# Altium project Dendrometro.PrjPcb
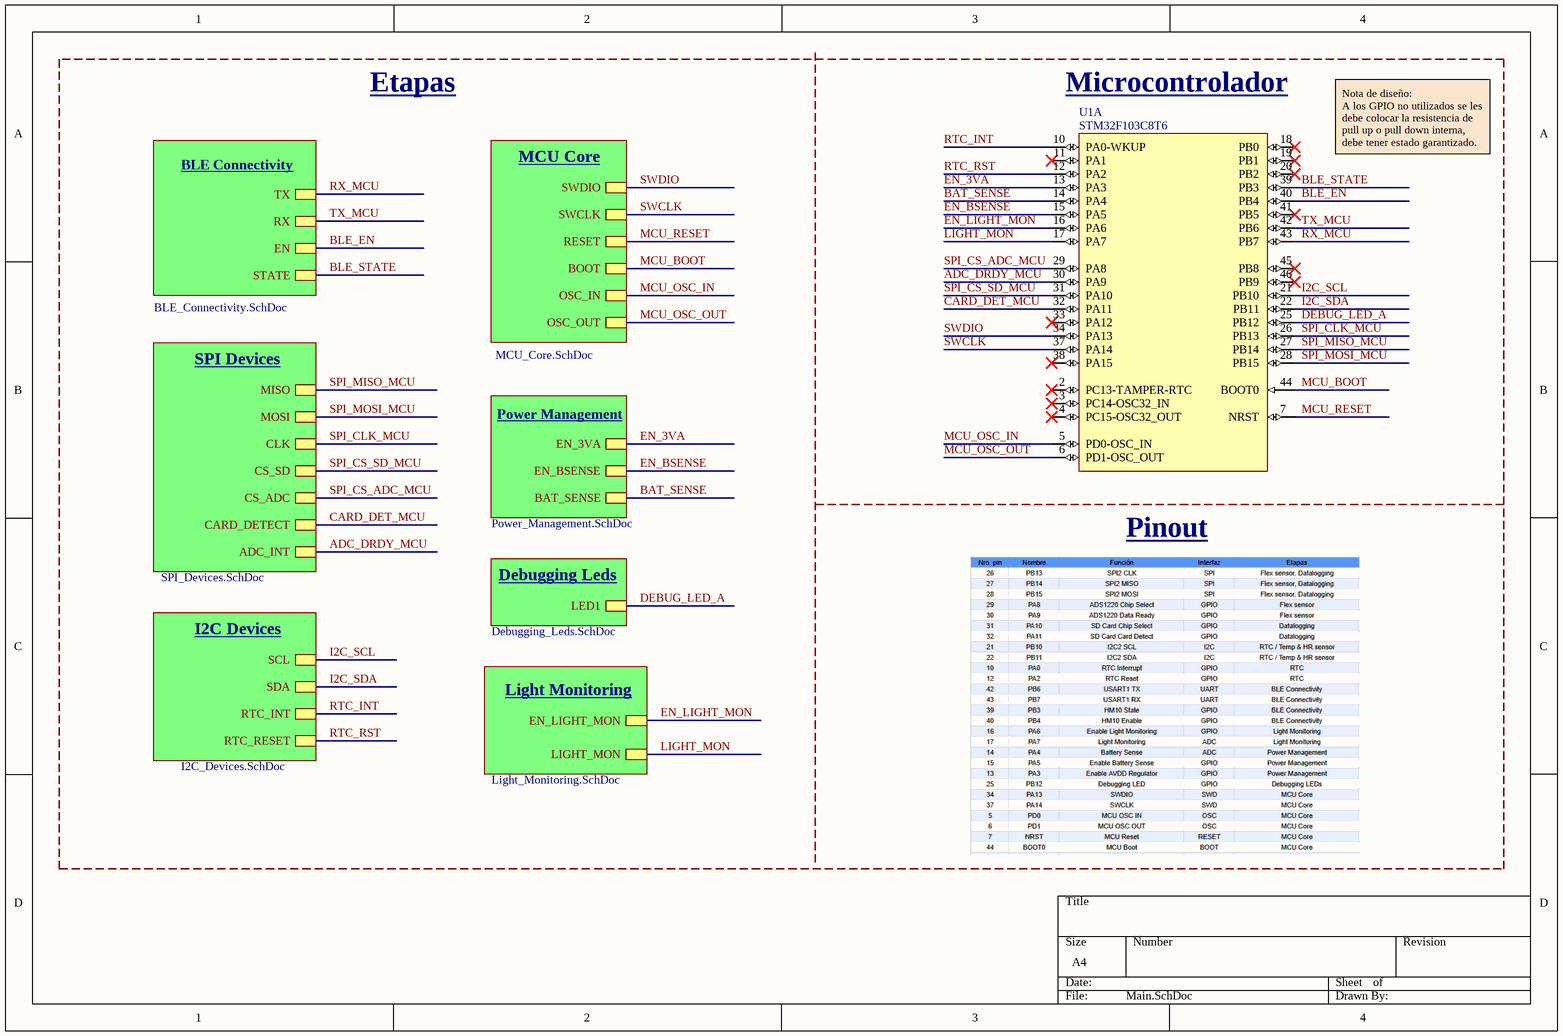
[diagram p0: Main.SchDoc]
11 sheets, 138 parts. Net scope: hierarchical (ports join the sheet entries above them; power ports are global).
Board file: Layout_Dendrometro.PcbDoc
Sheets:
  Main.SchDoc
    Power_Management = Power_Management.SchDoc
    MCU_Core = MCU_Core.SchDoc
    I2C_Devices = I2C_Devices.SchDoc
    BLE_Connectivity = BLE_Connectivity.SchDoc
    Light_Monitoring = Light_Monitoring.SchDoc
    SPI_Devices = SPI_Devices.SchDoc
      Datalogging = Datalogging.SchDoc
      Flex_Sensor = Flex_Sensor.SchDoc
        ADS_AFE = ADS_AFE.SchDoc
    Debugging_Leds = Debugging_Leds.SchDoc

## Sheet Main.SchDoc
size A4; SheetNumber: 1; SheetTotal: 11

### Parts
U1  STM32F103C8T6  [STM-LQFP48_L]  (part A of 2)

### Sub-sheets
BLE_Connectivity = BLE_Connectivity.SchDoc: TX, RX, EN, STATE  | Titulo: BLE Connectivity
Debugging_Leds = Debugging_Leds.SchDoc: LED1  | Titulo: Debugging Leds
I2C_Devices = I2C_Devices.SchDoc: SCL, SDA, RTC_INT, RTC_RESET  | Titulo: I2C Devices
Light_Monitoring = Light_Monitoring.SchDoc: EN_LIGHT_MON, LIGHT_MON  | Titulo: Light Monitoring
MCU_Core = MCU_Core.SchDoc: SWDIO, SWCLK, RESET, BOOT, OSC_IN, OSC_OUT  | Titulo: MCU Core
Power_Management = Power_Management.SchDoc: EN_3VA, BAT_SENSE, EN_BSENSE  | Titulo: Power Management
SPI_Devices = SPI_Devices.SchDoc: MISO, MOSI, CLK, CS_SD, CS_ADC, CARD_DETECT, ADC_INT  | Titulo: SPI Devices

### Nets
ADC_DRDY_MCU: U1.30(PA9) ; sheet SPI_Devices/ADC_INT
BAT_SENSE: U1.14(PA4) ; sheet Power_Management/BAT_SENSE
BLE_EN: U1.40(PB4) ; sheet BLE_Connectivity/EN
BLE_STATE: U1.39(PB3) ; sheet BLE_Connectivity/STATE
CARD_DET_MCU: U1.32(PA11) ; sheet SPI_Devices/CARD_DETECT
DEBUG_LED_A: U1.25(PB12) ; sheet Debugging_Leds/LED1
EN_3VA: U1.13(PA3) ; sheet Power_Management/EN_3VA
EN_BSENSE: U1.15(PA5) ; sheet Power_Management/EN_BSENSE
EN_LIGHT_MON: U1.16(PA6) ; sheet Light_Monitoring/EN_LIGHT_MON
I2C_SCL: U1.21(PB10) ; sheet I2C_Devices/SCL
I2C_SDA: U1.22(PB11) ; sheet I2C_Devices/SDA
LIGHT_MON: U1.17(PA7) ; sheet Light_Monitoring/LIGHT_MON
MCU_BOOT: U1.44(BOOT0) ; sheet MCU_Core/BOOT
MCU_OSC_IN: U1.5(PD0-OSC_IN) ; sheet MCU_Core/OSC_IN
MCU_OSC_OUT: U1.6(PD1-OSC_OUT) ; sheet MCU_Core/OSC_OUT
MCU_RESET: U1.7(NRST) ; sheet MCU_Core/RESET
RTC_INT: U1.10(PA0-WKUP) ; sheet I2C_Devices/RTC_INT
RTC_RST: U1.12(PA2) ; sheet I2C_Devices/RTC_RESET
RX_MCU: U1.43(PB7) ; sheet BLE_Connectivity/TX
SPI_CLK_MCU: U1.26(PB13) ; sheet SPI_Devices/CLK
SPI_CS_ADC_MCU: U1.29(PA8) ; sheet SPI_Devices/CS_ADC
SPI_CS_SD_MCU: U1.31(PA10) ; sheet SPI_Devices/CS_SD
SPI_MISO_MCU: U1.27(PB14) ; sheet SPI_Devices/MISO
SPI_MOSI_MCU: U1.28(PB15) ; sheet SPI_Devices/MOSI
SWCLK: U1.37(PA14) ; sheet MCU_Core/SWCLK
SWDIO: U1.34(PA13) ; sheet MCU_Core/SWDIO
TX_MCU: U1.42(PB6) ; sheet BLE_Connectivity/RX

Not connected (* = marked no-connect by the designer): U1 2(PC13-TAMPER-RTC)* 3(PC14-OSC32_IN)* 4(PC15-OSC32_OUT)* 11(PA1)* 18(PB0)* 19(PB1)* 20(PB2)* 33(PA12)* 38(PA15)* 41(PB5)* 45(PB8)* 46(PB9)*

### Notes on the sheet
- Etapas
- (near U1) Microcontrolador
- Nota de diseño:
  A los GPIO no utilizados se les debe colocar la resistencia de pull up o pull down interna, debe tener estado garantizado.
- Pinout

### Library data of the parts
U1 = STM32F103C8T6: ARM Cortex-M3 32-bit MCU, 64 KB Flash, 20 KB Internal RAM, 37 I/Os, 48-pin LQFP, -40 to 85 degC, Tray; Supply Voltage(Vcc) min (V): 2; Internal RAM Size (kB): 20; FLASH Size (Prog) (kB): 64; A/D Converter: 2x12-bit (10 Channel); I/Os (High Current): 37; Operating Frequency(F) (Processor speed) (MHz): 72; Core: ARM Cortex-M3; ComponentLink3Description: Package Specification; Mounting Technology: Surface Mount; PartNumber: STM32F103C8T6; PackageReference: LQFP48; Packing: Tray; ComponentLink3URL: http://www.st.com/st-web-ui/static/active/en/resource/technical/document/datasheet/DM00058181.pdf; DatasheetVersion: Rev. 16; ComponentLink1URL: http://www.st.com/web/en/home.html; PackageVersion: Rev. 6, 06/2013; ComponentLink2URL: http://www.st.com/st-web-ui/static/active/en/resource/technical/document/datasheet/CD00161566.pdf; ComponentLink1Description: Manufacturer URL; ComponentLink2Description: Datasheet; PackageDescription: 48-Pin Low Profile Quad Flat Package, 7 x 7 mm Body, 0.5 mm Pitch

## Sheet Power_Management.SchDoc
size A4; SheetNumber: 2; SheetTotal: 11
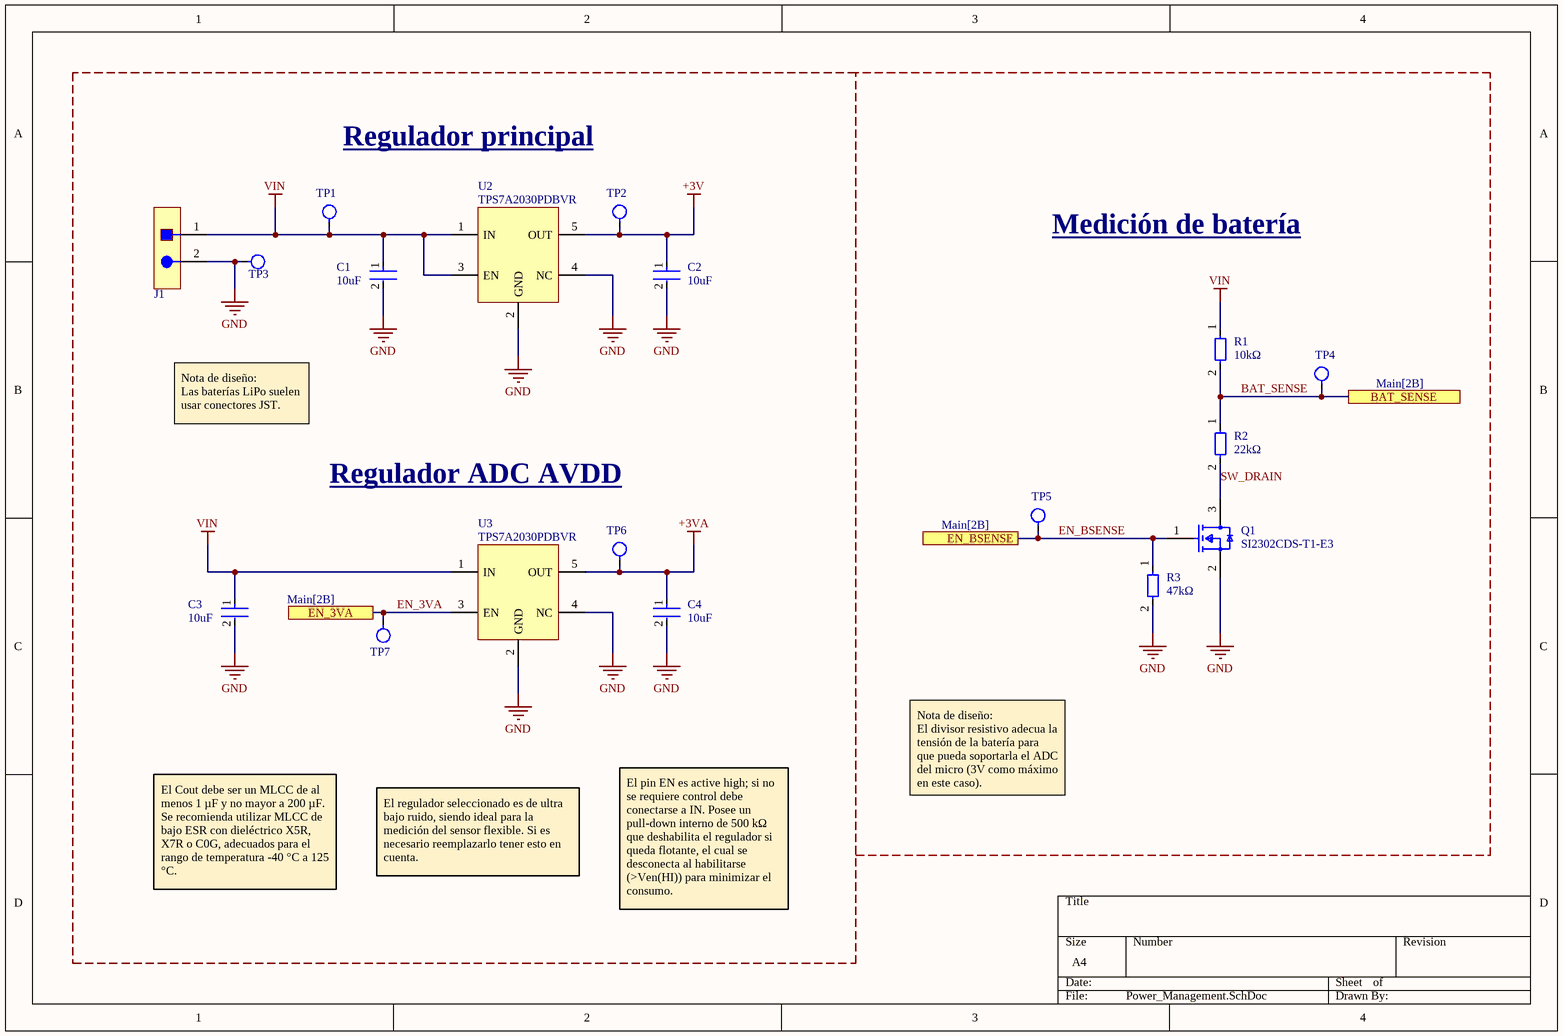
[diagram p1: Power_Management.SchDoc]

### Parts
C1  10uF  [CAP_0603]
C2  10uF  [CAP_0603]
C3  10uF  [CAP_0603]
C4  10uF  [CAP_0603]
J1  JST CONN  [JST_B2B-PH-K-S]  (value not drawn)
Q1  SI2302CDS-T1-E3  [FP-S-03946-MFG]
R1  value 10kΩ  [RES_0603]  (hidden comment: 10k)
R2  value 22kΩ  [RES_0603]  (hidden comment: 22k)
R3  value 47kΩ  [RES_0603]  (hidden comment: 47k)
TP1  Testpoint SMD  [Testpoint_SMD]  (value not drawn)  (no BOM)
TP2  Testpoint SMD  [Testpoint_SMD]  (value not drawn)  (no BOM)
TP3  Testpoint SMD  [Testpoint_SMD]  (value not drawn)  (no BOM)
TP4  Testpoint SMD  [Testpoint_SMD]  (value not drawn)  (no BOM)
TP5  Testpoint SMD  [Testpoint_SMD]  (value not drawn)  (no BOM)
TP6  Testpoint SMD  [Testpoint_SMD]  (value not drawn)  (no BOM)
TP7  Testpoint SMD  [Testpoint_SMD]  (value not drawn)  (no BOM)
U2  TPS7A2030PDBVR  [SOT-23]
U3  TPS7A2030PDBVR  [SOT-23]

### Ports
BAT_SENSE (see Main[2B]), EN_3VA (see Main[2B]), EN_BSENSE (see Main[2B])

### Nets
+3V: C2.1 TP2.1 U2.5(OUT)
+3VA: C4.1 TP6.1 U3.5(OUT)
GND: C1.2 C2.2 C3.2 C4.2 J1.2 Q1.2(S) R3.2 TP3.1 U2.2(GND) U2.4(NC) U3.2(GND) U3.4(NC)
VIN: C1.1 C3.1 J1.1 R1.1 TP1.1 U2.1(IN) U2.3(EN) U3.1(IN)
BAT_SENSE: R1.2 R2.1 TP4.1 ; port BAT_SENSE
EN_3VA: TP7.1 U3.3(EN) ; port EN_3VA
EN_BSENSE: Q1.1(G) R3.1 TP5.1 ; port EN_BSENSE
SW_DRAIN: Q1.3(D) R2.2

### Notes on the sheet
- Regulador principal
- Medición de batería
- Nota de diseño:
  Las baterías LiPo suelen usar conectores JST.
- Regulador ADC AVDD
- Nota de diseño:
  El divisor resistivo adecua la tensión de la batería para que pueda soportarla el ADC del micro (3V como máximo en este caso).
- El Cout debe ser un MLCC de al menos 1 µF y no mayor a 200 µF. Se recomienda utilizar MLCC de bajo ESR con dieléctrico X5R, X7R o C0G, adecuados para el rango de temperatura -40 °C a 125 °C.
- El regulador seleccionado es de ultra bajo ruido, siendo ideal para la medición del sensor flexible. Si es necesario reemplazarlo tener esto en cuenta.
- El pin EN es active high; si no se requiere control debe conectarse a IN. Posee un pull-down interno de 500 kΩ que deshabilita el regulador si queda flotante, el cual se desconecta al habilitarse (>Ven(HI)) para minimizar el consumo.

### Library data of the parts
C1-C4 = Generic C: Cap 10 uF 10V X7R 0603; Dielectric: X5R; Tolerance: 10%; Case Code (Imperial): 0805; Capacitance: 10uF; Mount: Surface Mount; Depth: 1.25mm; Length: 2mm; Lead Free: Lead Free; Packaging: Tape and Reel; Width: 0.049inch; Package Quantity: 1; Height: 1.25mm; Case/Package: 0805; Voltage Rating: 10V; Thickness: 0.053inch; Max Operating Temperature: 85°C; Case Code (Metric): 2012; Contact Plating: Tin; Min Operating Temperature: -55°C; Radiation Hardening: No; Voltage Rating (DC): 10V
J1 = B2B-PH-K-S: CONN JST HEADER VERT 2POS 2MM for LIPO batteries.
Q1 = CMP-02550-000184-1: MOSFET N-CH 20V 2.6A SOT-23; Manufacturer: Vishay; Gate To Source Voltage: 8V; Max Forward Diode Voltage: 1.2V; Pulse Drain Current: 10A; Typ Forward Diode Voltage: 0.7V; Number Of N Channels: 1; Reverse Recovery Charge: 2nC; Power Dissipation: 0.71W; Reverse Recovery Time: 8.5ns; Threshold Vgs Min: 0.4V; Drain To Source Resistance: 0.045Ω; Gate Charge At Vgs: 3.5nC @ 4.5V; Turn Off Delay Time: 30ns; Rthja Max: 140°C/W; Max Junction Temp: +150°C; Transconductance: 13S; Depletion Mode: False; Standoff Height: 0.01mm; Turn On Delay Time: 8ns; Threshold Vgs Max: 0.85V; Manufacturer Part Number: SI2302CDS-T1-E3; Mouser Description: MOSFET 20V 2.9A 0.86W 57mohm @ 4.5V; Digikey Description: MOSFET N-CH 20V 2.6A SOT-23; Drain To Source Voltage: 20V; Lead Free: Yes; Temperature Range High: +150°C; Automotive: No; ComponentLink2URL: http://www.vishay.com/docs/68645/si2302cds.pdf; Height: 1.12mm; ComponentLink2Description: Datasheet; Octopart: https://octopart.com/si2302cds-t1-e3-vishay-44452855; Continuous Drain Current: 2.6A; Drain To Source Breakdown Voltage: 20V; Number Of Channels: 1; Device Class L3: MOSFETs; Device Class L1: Discrete Semiconductors; Temperature Range Low: -55°C; Package: S-03946; RoHS: TRUE; Device Class L2: Transistors; Temperature: -55°C to +150°C; Category: Trans
R1 = Generic R: RES  10k 1% 0603
R2 = Generic R: RES  22k 1% 0603
R3 = Generic R: RES  47k 1% 0603
TP1-TP7 = Testpoint_SMD: Testpoint SMD de 1mm de diametro.
U2 U3 = TPS7A2030PDBVR: IC REG LINEAR 3V 300MA SOT23-5

## Sheet MCU_Core.SchDoc
size A4; SheetNumber: 3; SheetTotal: 11
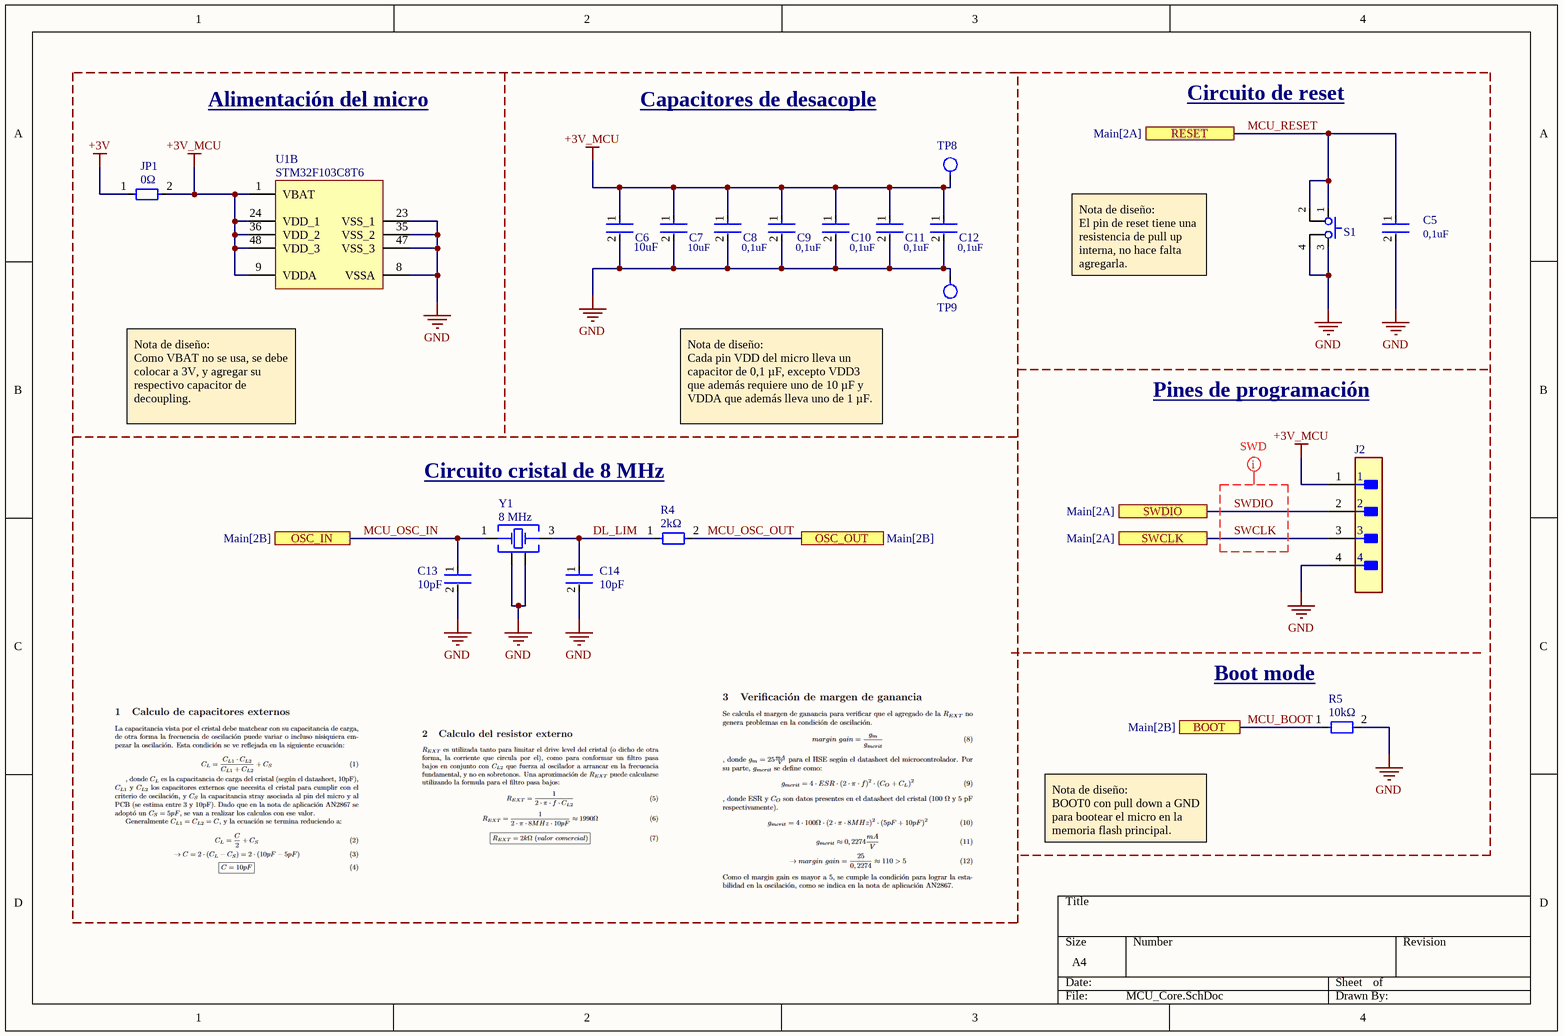
[diagram p2: MCU_Core.SchDoc]

### Parts
C5  Capacitance: 0,1uF  [CAP_0603]  (hidden comment: 0.1uF)
C6  10uF  [CAP_0603]
C7  10uF  [CAP_0603]
C8  Capacitance: 0,1uF  [CAP_0603]  (hidden comment: 0.1uF)
C9  Capacitance: 0,1uF  [CAP_0603]  (hidden comment: 0.1uF)
C10  Capacitance: 0,1uF  [CAP_0603]  (hidden comment: 0.1uF)
C11  Capacitance: 0,1uF  [CAP_0603]  (hidden comment: 0.1uF)
C12  Capacitance: 0,1uF  [CAP_0603]  (hidden comment: 0.1uF)
C13  10pF  [CAP_0603]
C14  10pF  [CAP_0603]
J2  HTSW-104-07-G-S  [FP-HTSW-104-07-G-S-MFG]  (value not drawn)
JP1  value 0Ω  [RES_0R_0603]  (hidden comment: Generic JP)  (no BOM)
R4  value 2kΩ  [RES_0603]  (hidden comment: 2k)
R5  value 10kΩ  [RES_0603]  (hidden comment: 10k)
S1  Tactile push button 5,2mm x 5,2mm  [Switch Tactile 5,2mm x 5,2mm]  (value not drawn)
TP8  Testpoint SMD  [Testpoint_SMD]  (value not drawn)  (no BOM)
TP9  Testpoint SMD  [Testpoint_SMD]  (value not drawn)  (no BOM)
U1  STM32F103C8T6  [STM-LQFP48_L]  (part B of 2)
Y1  Frequency: 8 MHz  [SMD5032-4P]  (hidden comment: Crystal SMD 4-P)

### Ports
BOOT (see Main[2B]), OSC_IN (see Main[2B]), OSC_OUT (see Main[2B]), RESET (see Main[2A]), SWCLK (see Main[2A]), SWDIO (see Main[2A])

### Nets
+3V: JP1.1
+3V_MCU: C6.1 C7.1 C8.1 C9.1 C10.1 C11.1 C12.1 J2.1 JP1.2 TP8.1 U1.1(VBAT) U1.9(VDDA) U1.24(VDD_1) U1.36(VDD_2) U1.48(VDD_3)
GND: C5.2 C6.2 C7.2 C8.2 C9.2 C10.2 C11.2 C12.2 C13.2 C14.2 J2.4 R5.2 S1.3 S1.4 TP9.1 U1.8(VSSA) U1.23(VSS_1) U1.35(VSS_2) U1.47(VSS_3) Y1.2(GND_&_Lid) Y1.4(GND_&_Lid)
DL_LIM: C14.1 R4.1 Y1.3(Crystal)
MCU_BOOT: R5.1 ; port BOOT
MCU_OSC_IN: C13.1 Y1.1(Crystal) ; port OSC_IN
MCU_OSC_OUT: R4.2 ; port OSC_OUT
MCU_RESET: C5.1 S1.1 S1.2 ; port RESET
SWCLK: J2.3 ; port SWCLK
SWDIO: J2.2 ; port SWDIO

### Layout directives
net class SWD: SWCLK, SWDIO

### Notes on the sheet
- Alimentación del micro
- Capacitores de desacople
- Circuito de reset
- Nota de diseño:
  El pin de reset tiene una resistencia de pull up interna, no hace falta agregarla.
- Nota de diseño:
  Como VBAT no se usa, se debe colocar a 3V, y agregar su respectivo capacitor de decoupling.
- Nota de diseño:
  Cada pin VDD del micro lleva un capacitor de 0,1 µF, excepto VDD3 que además requiere uno de 10 µF y VDDA que además lleva uno de 1 µF.
- Pines de programación
- Circuito cristal de 8 MHz
- (near R5) Boot mode
- Nota de diseño:
  BOOT0 con pull down a GND para bootear el micro en la memoria flash principal.

### Library data of the parts
C5 C8-C12 = Generic C: Cap 0.1 uF 10V X7R 0603; Dielectric: X5R; Tolerance: 10%; Case Code (Imperial): 0805; Mount: Surface Mount; Depth: 1.25mm; Length: 2mm; Lead Free: Lead Free; Packaging: Tape and Reel; Width: 0.049inch; Package Quantity: 1; Height: 1.25mm; Case/Package: 0805; Voltage Rating: 10V; Thickness: 0.053inch; Max Operating Temperature: 85°C; Case Code (Metric): 2012; Contact Plating: Tin; Min Operating Temperature: -55°C; Radiation Hardening: No; Voltage Rating (DC): 10V
C6 C7 = Generic C: as C1 on sheet Power_Management; Case Code (Imperial): 0805; Capacitance: 10uF; Mount: Surface Mount; Depth: 1.25mm; Length: 2mm; Lead Free: Lead Free; Packaging: Tape and Reel; Width: 0.049inch; Package Quantity: 1; Height: 1.25mm; Case/Package: 0805; Voltage Rating: 10V; Thickness: 0.053inch; Max Operating Temperature: 85°C; Case Code (Metric): 2012; Contact Plating: Tin; Min Operating Temperature: -55°C; Radiation Hardening: No; Voltage Rating (DC): 10V
C13 C14 = Generic C: Cap 10 pF 10V X7R 0603; Dielectric: X5R; Tolerance: 10%; Case Code (Imperial): 0805; Capacitance: 10pF; Mount: Surface Mount; Depth: 1.25mm; Length: 2mm; Lead Free: Lead Free; Packaging: Tape and Reel; Width: 0.049inch; Package Quantity: 1; Height: 1.25mm; Case/Package: 0805; Voltage Rating: 10V; Thickness: 0.053inch; Max Operating Temperature: 85°C; Case Code (Metric): 2012; Contact Plating: Tin; Min Operating Temperature: -55°C; Radiation Hardening: No; Voltage Rating (DC): 10V
J2 = CMP-02766-001776-1: CONN HEADER VERT 4POS 2.54MM; Gender: Male; Number of Contacts: 4; Packaging: Bulk; RoHS Compliant: Yes; Number of Rows: 1; Mount: Through Hole; Contact Material: Bronze; Series: HTSW; Radiation Hardening: No; Pitch: 2.54mm; Reach SVHC Compliant: Yes; Contact Plating: Gold; Termination: Through Hole
JP1 = Generic JP: Generic Jumper
R4 = Generic R: RES  2k 1% 0603
R5 = Generic R: RES  10k 1% 0603
S1 = Tactile push button 5,2mm x 5,2mm: Switch Tactile SPST-NO 5,2mm x 5,2mm
TP8 TP9 = Testpoint_SMD: Testpoint SMD de 1mm de diametro.
U1 = STM32F103C8T6: as U1 on sheet Main; Core: ARM Cortex-M3; ComponentLink3Description: Package Specification; Mounting Technology: Surface Mount; PartNumber: STM32F103C8T6; PackageReference: LQFP48; Packing: Tray; ComponentLink3URL: http://www.st.com/st-web-ui/static/active/en/resource/technical/document/datasheet/DM00058181.pdf; DatasheetVersion: Rev. 16; ComponentLink1URL: http://www.st.com/web/en/home.html; PackageVersion: Rev. 6, 06/2013; ComponentLink2URL: http://www.st.com/st-web-ui/static/active/en/resource/technical/document/datasheet/CD00161566.pdf; ComponentLink1Description: Manufacturer URL; ComponentLink2Description: Datasheet; PackageDescription: 48-Pin Low Profile Quad Flat Package, 7 x 7 mm Body, 0.5 mm Pitch
Y1 = Crystal SMD 4-P: Cristal SMD 4-P 8 MHz; Manufacturer part: SX5B8.000F1020F30; Manufacturer: Shenzhen SCTF Elec; CL: 10 pF; ESR: 100 Ω; Datasheet: https://jlcpcb.com/api/file/downloadByFileSystemAccessId/8590208237112238080; Package: SMD5032-4P

## Sheet I2C_Devices.SchDoc
size A4; SheetNumber: 4; SheetTotal: 11
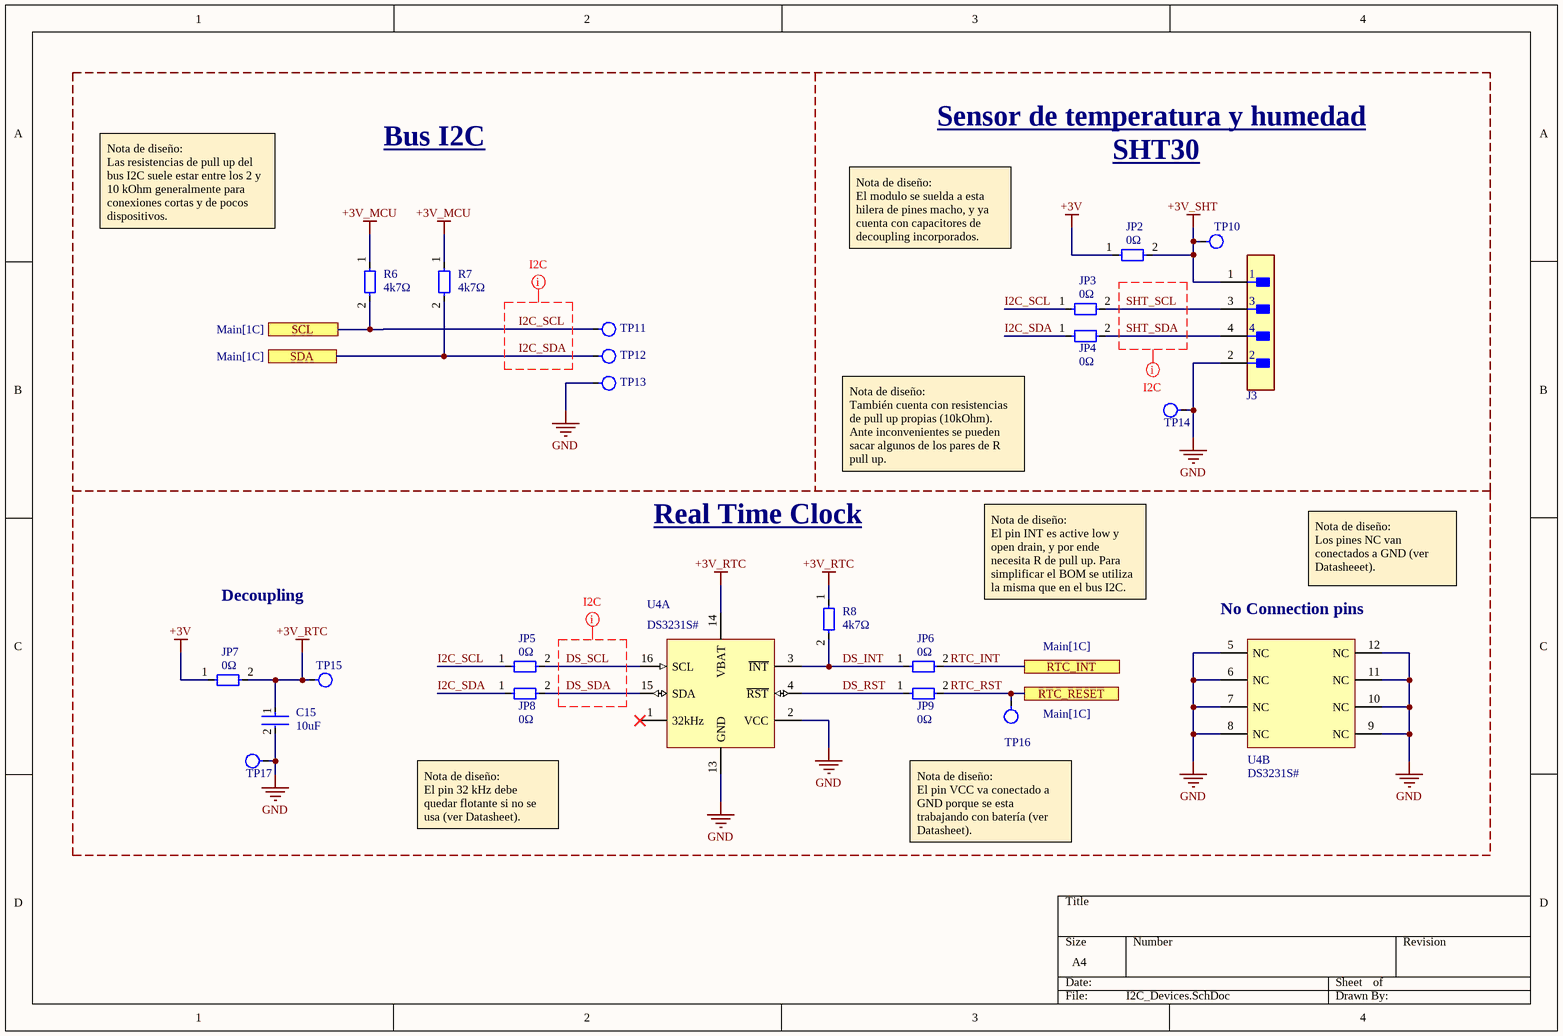
[diagram p3: I2C_Devices.SchDoc]

### Parts
C15  10uF  [CAP_0603]
J3  HTSW-104-07-G-S  [FP-HTSW-104-07-G-S-MFG]  (value not drawn)
JP2  value 0Ω  [RES_0R_0603]  (hidden comment: Generic JP)  (no BOM)
JP3  value 0Ω  [RES_0R_0603]  (hidden comment: Generic JP)  (no BOM)
JP4  value 0Ω  [RES_0R_0603]  (hidden comment: Generic JP)  (no BOM)
JP5  value 0Ω  [RES_0R_0603]  (hidden comment: Generic JP)  (no BOM)
JP6  value 0Ω  [RES_0R_0603]  (hidden comment: Generic JP)  (no BOM)
JP7  value 0Ω  [RES_0R_0603]  (hidden comment: Generic JP)  (no BOM)
JP8  value 0Ω  [RES_0R_0603]  (hidden comment: Generic JP)  (no BOM)
JP9  value 0Ω  [RES_0R_0603]  (hidden comment: Generic JP)  (no BOM)
R6  value 4k7Ω  [RES_0603]  (hidden comment: 4k7)
R7  value 4k7Ω  [RES_0603]  (hidden comment: 4k7)
R8  value 4k7Ω  [RES_0603]  (hidden comment: 4k7)
TP10  Testpoint SMD  [Testpoint_SMD]  (value not drawn)  (no BOM)
TP11  Testpoint SMD  [Testpoint_SMD]  (value not drawn)  (no BOM)
TP12  Testpoint SMD  [Testpoint_SMD]  (value not drawn)  (no BOM)
TP13  Testpoint SMD  [Testpoint_SMD]  (value not drawn)  (no BOM)
TP14  Testpoint SMD  [Testpoint_SMD]  (value not drawn)  (no BOM)
TP15  Testpoint SMD  [Testpoint_SMD]  (value not drawn)  (no BOM)
TP16  Testpoint SMD  [Testpoint_SMD]  (value not drawn)  (no BOM)
TP17  Testpoint SMD  [Testpoint_SMD]  (value not drawn)  (no BOM)
U4  DS3231S#  [SOIC_16_M]  (parts A,B of 2)

### Ports
RTC_INT (see Main[1C]), RTC_RESET (see Main[1C]), SCL (see Main[1C]), SDA (see Main[1C])

### Nets
+3V: JP2.1 JP7.1
+3V_MCU: R6.1 R7.1
+3V_RTC: C15.1 JP7.2 R8.1 TP15.1 U4.14(VBAT)
+3V_SHT: J3.1 JP2.2 TP10.1
GND: C15.2 J3.2 TP13.1 TP14.1 TP17.1 U4.2(VCC) U4.5(NC) U4.6(NC) U4.7(NC) U4.8(NC) U4.9(NC) U4.10(NC) U4.11(NC) U4.12(NC) U4.13(GND)
DS_INT: JP6.1 R8.2 U4.3(~{INT})
DS_RST: JP9.1 U4.4(~{RST})
DS_SCL: JP5.2 U4.16(SCL)
DS_SDA: JP8.2 U4.15(SDA)
I2C_SCL: JP3.1 JP5.1 R6.2 TP11.1 ; port SCL
I2C_SDA: JP4.1 JP8.1 R7.2 TP12.1 ; port SDA
RTC_INT: JP6.2 ; port RTC_INT
RTC_RST: JP9.2 TP16.1 ; port RTC_RESET
SHT_SCL: J3.3 JP3.2
SHT_SDA: J3.4 JP4.2

Not connected (* = marked no-connect by the designer): U4 1(32kHz)*

### Layout directives
net class I2C: DS_SCL, DS_SDA, I2C_SCL, I2C_SDA, SHT_SCL, SHT_SDA

### Notes on the sheet
- Bus I2C
- Sensor de temperatura y humedad
- SHT30
- Nota de diseño:
  Las resistencias de pull up del bus I2C suele estar entre los 2 y 10 kOhm generalmente para conexiones cortas y de pocos dispositivos.
- Nota de diseño:
  El modulo se suelda a esta hilera de pines macho, y ya cuenta con capacitores de decoupling incorporados.
- Nota de diseño:
  También cuenta con resistencias de pull up propias (10kOhm). Ante inconvenientes se pueden sacar algunos de los pares de R pull up.
- Real Time Clock
- Nota de diseño:
  Los pines NC van conectados a GND (ver Datasheeet).
- Decoupling
- Nota de diseño:
  El pin INT es active low y open drain, y por ende necesita R de pull up. Para simplificar el BOM se utiliza la misma que en el bus I2C.
- (near U4) No Connection pins
- Nota de diseño:
  El pin 32 kHz debe quedar flotante si no se usa (ver Datasheet).
- Nota de diseño:
  El pin VCC va conectado a GND porque se esta trabajando con batería (ver Datasheet).

### Library data of the parts
C15 = Generic C: Cap 10  uF 10V X7R 0603; Dielectric: X5R; Tolerance: 10%; Case Code (Imperial): 0805; Capacitance: 10uF; Mount: Surface Mount; Depth: 1.25mm; Length: 2mm; Lead Free: Lead Free; Packaging: Tape and Reel; Width: 0.049inch; Package Quantity: 1; Height: 1.25mm; Case/Package: 0805; Voltage Rating: 10V; Thickness: 0.053inch; Max Operating Temperature: 85°C; Case Code (Metric): 2012; Contact Plating: Tin; Min Operating Temperature: -55°C; Radiation Hardening: No; Voltage Rating (DC): 10V
J3 = CMP-02766-001776_ALT: CONN HEADER VERT 4POS 2.54MM. Versión alterna.; Gender: Male; Number of Contacts: 4; Pitch: 2.54mm; Packaging: Bulk; RoHS Compliant: Yes; Number of Rows: 1; Mount: Through Hole; Contact Material: Bronze; Series: HTSW; Radiation Hardening: No; Reach SVHC Compliant: Yes; Contact Plating: Gold; Termination: Through Hole
JP2-JP9 = Generic JP: Simbolo de jumper genérico
R6-R8 = Generic R: RES  4k7 1% 0603
TP10-TP17 = Testpoint_SMD: Testpoint SMD de 1mm de diametro.
U4 = DS3231S# for battery use: IC RTC CLK/CALENDAR I2C 16SOIC. Symbol used with battery as the main supply voltage.

## Sheet BLE_Connectivity.SchDoc
size A4; SheetNumber: 5; SheetTotal: 11
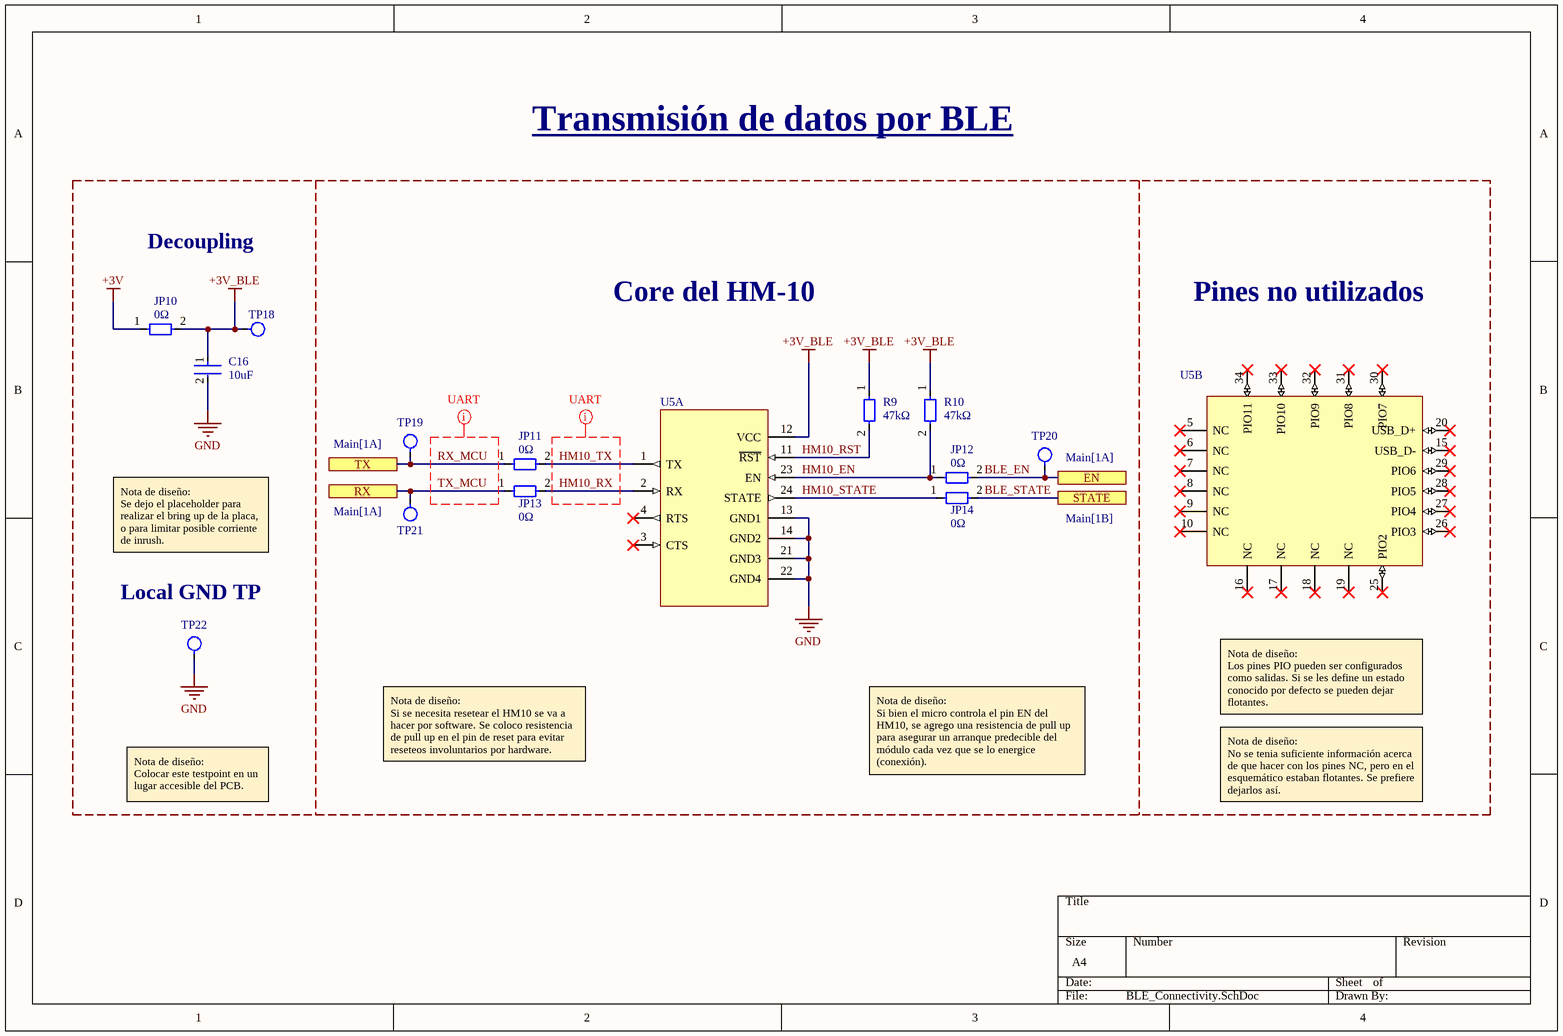
[diagram p4: BLE_Connectivity.SchDoc]

### Parts
C16  10uF  [CAP_0603]
JP10  value 0Ω  [RES_0R_0603]  (hidden comment: Generic JP)  (no BOM)
JP11  value 0Ω  [RES_0R_0603]  (hidden comment: Generic JP)  (no BOM)
JP12  value 0Ω  [RES_0R_0603]  (hidden comment: Generic JP)  (no BOM)
JP13  value 0Ω  [RES_0R_0603]  (hidden comment: Generic JP)  (no BOM)
JP14  value 0Ω  [RES_0R_0603]  (hidden comment: Generic JP)  (no BOM)
R9  value 47kΩ  [RES_0603]  (hidden comment: 47k)
R10  value 47kΩ  [RES_0603]  (hidden comment: 47k)
TP18  Testpoint SMD  [Testpoint_SMD]  (value not drawn)  (no BOM)
TP19  Testpoint SMD  [Testpoint_SMD]  (value not drawn)  (no BOM)
TP20  Testpoint SMD  [Testpoint_SMD]  (value not drawn)  (no BOM)
TP21  Testpoint SMD  [Testpoint_SMD]  (value not drawn)  (no BOM)
TP22  Testpoint SMD  [Testpoint_SMD]  (value not drawn)  (no BOM)
U5  HM10 BLE Module  [HM10_FOOTPRINT]  (value not drawn)  (parts A,B of 2)

### Ports
EN (see Main[1A]), RX (see Main[1A]), STATE (see Main[1B]), TX (see Main[1A])

### Nets
+3V: JP10.1
+3V_BLE: C16.1 JP10.2 R9.1 R10.1 TP18.1 U5.12(VCC)
GND: C16.2 TP22.1 U5.13(GND1) U5.14(GND2) U5.21(GND3) U5.22(GND4)
BLE_EN: JP12.2 TP20.1 ; port EN
BLE_STATE: JP14.2 ; port STATE
HM10_EN: JP12.1 R10.2 U5.23(EN)
HM10_RST: R9.2 U5.11(~{RST})
HM10_RX: JP13.2 U5.2(RX)
HM10_STATE: JP14.1 U5.24(STATE)
HM10_TX: JP11.2 U5.1(TX)
RX_MCU: JP11.1 TP19.1 ; port TX
TX_MCU: JP13.1 TP21.1 ; port RX

Not connected (* = marked no-connect by the designer): U5 3(CTS)* 4(RTS)* 5(NC)* 6(NC)* 7(NC)* 8(NC)* 9(NC)* 10(NC)* 15(USB_D-)* 16(NC)* 17(NC)* 18(NC)* 19(NC)* 20(USB_D+)* 25(PIO2)* 26(PIO3)* 27(PIO4)* 28(PIO5)* 29(PIO6)* 30(PIO7)* 31(PIO8)* 32(PIO9)* 33(PIO10)* 34(PIO11)*

### Layout directives
net class UART: HM10_RX, HM10_TX, RX_MCU, TX_MCU

### Notes on the sheet
- Transmisión de datos por BLE
- Decoupling
- Core del HM-10
- Pines no utilizados
- Nota de diseño:
  Se dejo el placeholder para realizar el bring up de la placa, o para limitar posible corriente de inrush.
- (near TP22) Local GND TP
- Nota de diseño:
  Los pines PIO pueden ser configurados como salidas. Si se les define un estado conocido por defecto se pueden dejar flotantes.
- Nota de diseño:
  Si se necesita resetear el HM10 se va a hacer por software. Se coloco resistencia de pull up en el pin de reset para evitar reseteos involuntarios por hardware.
- Nota de diseño:
  Si bien el micro controla el pin EN del HM10, se agrego una resistencia de pull up para asegurar un arranque predecible del módulo cada vez que se lo energice (conexión).
- Nota de diseño:
  Colocar este testpoint en un lugar accesible del PCB.
- Nota de diseño:
  No se tenia suficiente información acerca de que hacer con los pines NC, pero en el esquemático estaban flotantes. Se prefiere dejarlos así.

### Library data of the parts
C16 = Generic C: as C1 on sheet Power_Management; Case Code (Imperial): 0805; Capacitance: 10uF; Mount: Surface Mount; Depth: 1.25mm; Length: 2mm; Lead Free: Lead Free; Packaging: Tape and Reel; Width: 0.049inch; Package Quantity: 1; Height: 1.25mm; Case/Package: 0805; Voltage Rating: 10V; Thickness: 0.053inch; Max Operating Temperature: 85°C; Case Code (Metric): 2012; Contact Plating: Tin; Min Operating Temperature: -55°C; Radiation Hardening: No; Voltage Rating (DC): 10V
JP10-JP14 = Generic JP: Simbolo de jumper genérico
R9 R10 = Generic R: RES  47k 1% 0603
TP18-TP22 = Testpoint_SMD: Testpoint SMD de 1mm de diametro.
U5 = HM10: Modulo BLE HM10 con castellated pads.

## Sheet Light_Monitoring.SchDoc
size A4; SheetNumber: 6; SheetTotal: 11
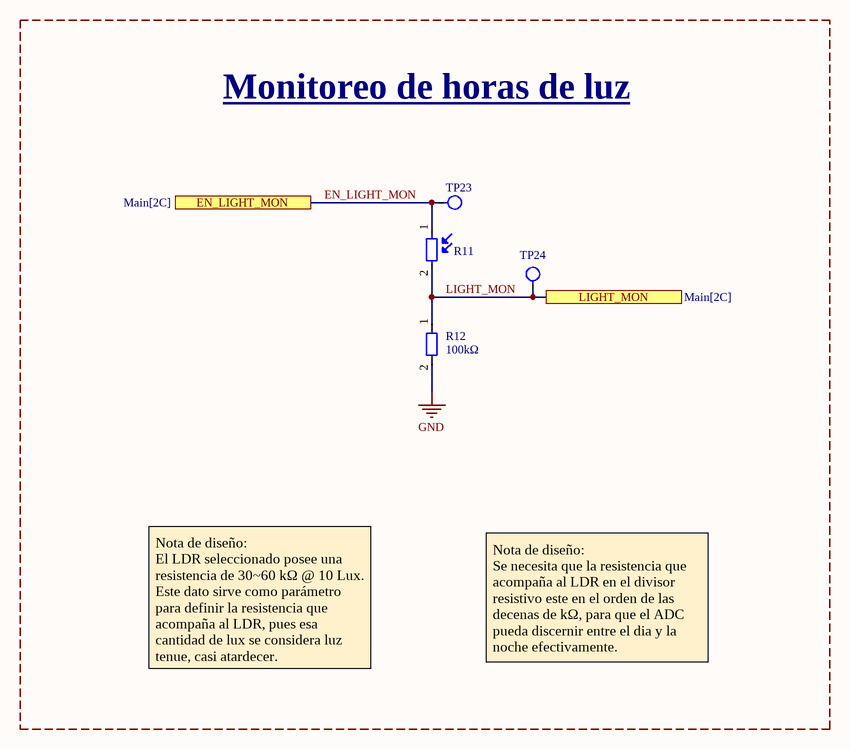
[diagram p5: Light_Monitoring.SchDoc]

### Parts
R11  LDR  [Generic LDR]  (value not drawn)
R12  value 100kΩ  [RES_0603]  (hidden comment: 100k)
TP23  Testpoint SMD  [Testpoint_SMD]  (value not drawn)  (no BOM)
TP24  Testpoint SMD  [Testpoint_SMD]  (value not drawn)  (no BOM)

### Blocks framed on the sheet
Monitoreo de horas de luz: R11 R12 TP23 TP24

### Ports
EN_LIGHT_MON (see Main[2C]), LIGHT_MON (see Main[2C])

### Nets
GND: R12.2
EN_LIGHT_MON: R11.1 TP23.1 ; port EN_LIGHT_MON
LIGHT_MON: R11.2 R12.1 TP24.1 ; port LIGHT_MON

### Notes on the sheet
- Nota de diseño:
  El LDR seleccionado posee una resistencia de 30~60 kΩ @ 10 Lux. Este dato sirve como parámetro para definir la resistencia que acompaña al LDR, pues esa cantidad de lux se considera luz tenue, casi atardecer.
- Nota de diseño:
  Se necesita que la resistencia que acompaña al LDR en el divisor resistivo este en el orden de las decenas de kΩ, para que el ADC pueda discernir entre el dia y la noche efectivamente.

### Library data of the parts
R11 = Generic LDR: LDR for sensing daylight hours.; Light Resistance: 10kΩ; Dark Resistance: 1MΩ; Spectral Response Range: 400-700nm; Diameter: 5mm
R12 = Generic R: RES  100k 1% 0603
TP23 TP24 = Testpoint_SMD: Testpoint SMD de 1mm de diametro.

## Sheet SPI_Devices.SchDoc
size A4; SheetNumber: 7; SheetTotal: 11
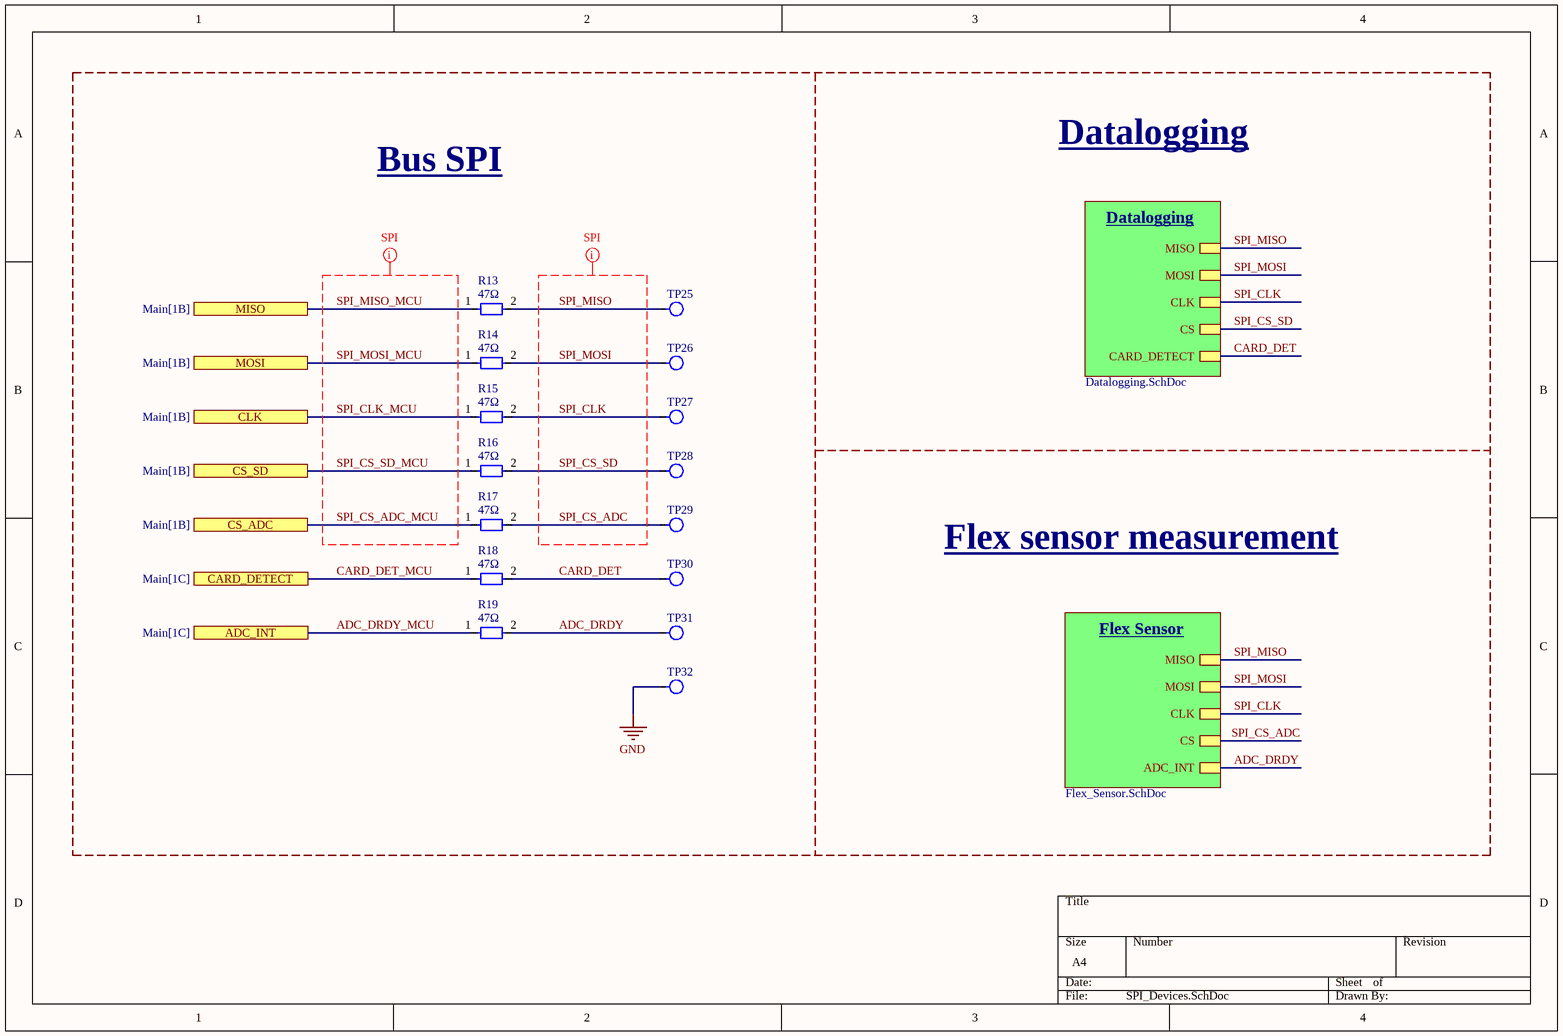
[diagram p6: SPI_Devices.SchDoc]

### Parts
R13  value 47Ω  [RES_0603]  (hidden comment: 47R)
R14  value 47Ω  [RES_0603]  (hidden comment: 47R)
R15  value 47Ω  [RES_0603]  (hidden comment: 47R)
R16  value 47Ω  [RES_0603]  (hidden comment: 47R)
R17  value 47Ω  [RES_0603]  (hidden comment: 47R)
R18  value 47Ω  [RES_0603]  (hidden comment: 47R)
R19  value 47Ω  [RES_0603]  (hidden comment: 47R)
TP25  Testpoint SMD  [Testpoint_SMD]  (value not drawn)  (no BOM)
TP26  Testpoint SMD  [Testpoint_SMD]  (value not drawn)  (no BOM)
TP27  Testpoint SMD  [Testpoint_SMD]  (value not drawn)  (no BOM)
TP28  Testpoint SMD  [Testpoint_SMD]  (value not drawn)  (no BOM)
TP29  Testpoint SMD  [Testpoint_SMD]  (value not drawn)  (no BOM)
TP30  Testpoint SMD  [Testpoint_SMD]  (value not drawn)  (no BOM)
TP31  Testpoint SMD  [Testpoint_SMD]  (value not drawn)  (no BOM)
TP32  Testpoint SMD  [Testpoint_SMD]  (value not drawn)  (no BOM)

### Sub-sheets
Datalogging = Datalogging.SchDoc: MISO, MOSI, CLK, CS, CARD_DETECT  | Titulo: Datalogging
Flex_Sensor = Flex_Sensor.SchDoc: MISO, MOSI, CLK, CS, ADC_INT  | Titulo: Flex Sensor

### Ports
ADC_INT (see Main[1C]), CARD_DETECT (see Main[1C]), CLK (see Main[1B]), CS_ADC (see Main[1B]), CS_SD (see Main[1B]), MISO (see Main[1B]), MOSI (see Main[1B])

### Nets
GND: TP32.1
ADC_DRDY: R19.2 TP31.1 ; sheet Flex_Sensor/ADC_INT
ADC_DRDY_MCU: R19.1 ; port ADC_INT
CARD_DET: R18.2 TP30.1 ; sheet Datalogging/CARD_DETECT
CARD_DET_MCU: R18.1 ; port CARD_DETECT
SPI_CLK: R15.2 TP27.1 ; sheet Datalogging/CLK, sheet Flex_Sensor/CLK
SPI_CLK_MCU: R15.1 ; port CLK
SPI_CS_ADC: R17.2 TP29.1 ; sheet Flex_Sensor/CS
SPI_CS_ADC_MCU: R17.1 ; port CS_ADC
SPI_CS_SD: R16.2 TP28.1 ; sheet Datalogging/CS
SPI_CS_SD_MCU: R16.1 ; port CS_SD
SPI_MISO: R13.2 TP25.1 ; sheet Datalogging/MISO, sheet Flex_Sensor/MISO
SPI_MISO_MCU: R13.1 ; port MISO
SPI_MOSI: R14.2 TP26.1 ; sheet Datalogging/MOSI, sheet Flex_Sensor/MOSI
SPI_MOSI_MCU: R14.1 ; port MOSI

### Layout directives
net class SPI: SPI_CLK, SPI_CLK_MCU, SPI_CS_ADC, SPI_CS_ADC_MCU, SPI_CS_SD, SPI_CS_SD_MCU, SPI_MISO, SPI_MISO_MCU, SPI_MOSI, SPI_MOSI_MCU

### Notes on the sheet
- Bus SPI
- Datalogging
- Flex sensor measurement

### Library data of the parts
R13-R19 = Generic R: RES  47R 1% 0603
TP25-TP32 = Testpoint_SMD: Testpoint SMD de 1mm de diametro.

## Sheet Datalogging.SchDoc
size A4; SheetNumber: 8; SheetTotal: 11
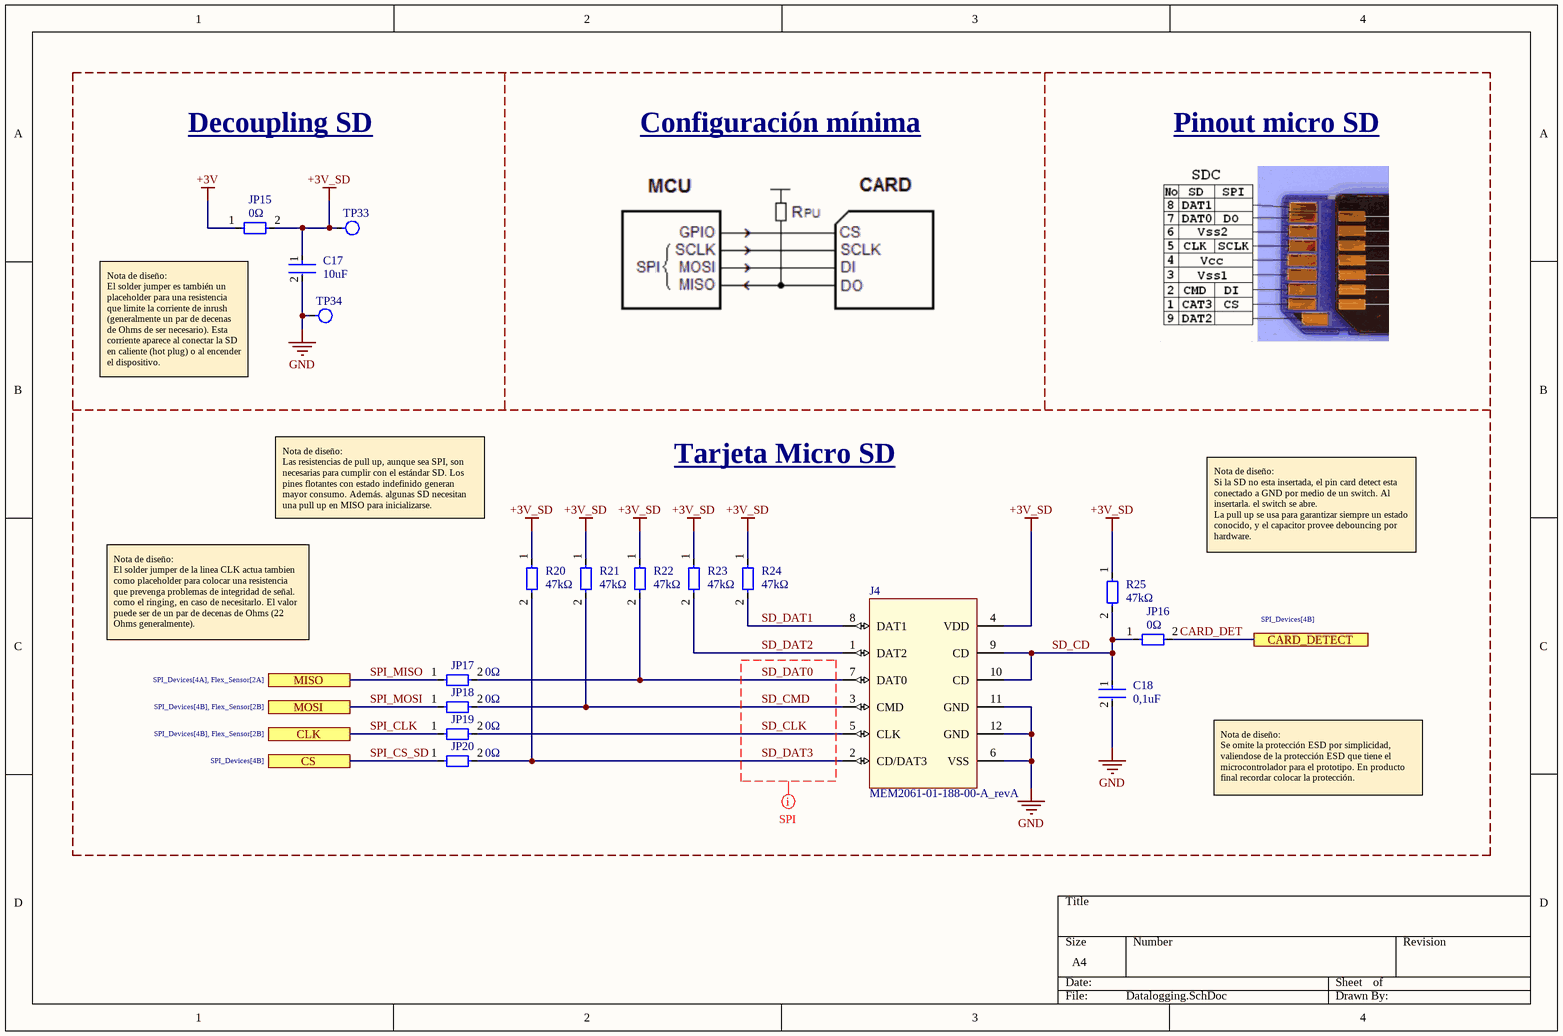
[diagram p7: Datalogging.SchDoc]

### Parts
C17  10uF  [CAP_0603]
C18  Capacitance: 0,1uF  [CAP_0603]  (hidden comment: 0.1uF)
J4  MEM2061-01-188-00-A_revA  [MEM2061-01-188-00-A_revA]
JP15  value 0Ω  [RES_0R_0603]  (hidden comment: Generic JP)  (no BOM)
JP16  value 0Ω  [RES_0R_0603]  (hidden comment: Generic JP)  (no BOM)
JP17  value 0Ω  [RES_0R_0603]  (hidden comment: Generic JP)  (no BOM)
JP18  value 0Ω  [RES_0R_0603]  (hidden comment: Generic JP)  (no BOM)
JP19  value 0Ω  [RES_0R_0603]  (hidden comment: Generic JP)  (no BOM)
JP20  value 0Ω  [RES_0R_0603]  (hidden comment: Generic JP)  (no BOM)
R20  value 47kΩ  [RES_0603]  (hidden comment: 47k)
R21  value 47kΩ  [RES_0603]  (hidden comment: 47k)
R22  value 47kΩ  [RES_0603]  (hidden comment: 47k)
R23  value 47kΩ  [RES_0603]  (hidden comment: 47k)
R24  value 47kΩ  [RES_0603]  (hidden comment: 47k)
R25  value 47kΩ  [RES_0603]  (hidden comment: 47k)
TP33  Testpoint SMD  [Testpoint_SMD]  (value not drawn)  (no BOM)
TP34  Testpoint SMD  [Testpoint_SMD]  (value not drawn)  (no BOM)

### Ports
CARD_DETECT (see SPI_Devices[4B]), CLK (see SPI_Devices[4B], Flex_Sensor[2B]), CS (see SPI_Devices[4B]), MISO (see SPI_Devices[4A], Flex_Sensor[2A]), MOSI (see SPI_Devices[4B], Flex_Sensor[2B])

### Nets
+3V: JP15.1
+3V_SD: C17.1 J4.4(VDD) JP15.2 R20.1 R21.1 R22.1 R23.1 R24.1 R25.1 TP33.1
GND: C17.2 C18.2 J4.6(VSS) J4.11(GND) J4.12(GND) TP34.1
CARD_DET: JP16.2 ; port CARD_DETECT
SD_CD: C18.1 J4.9(CD) J4.10(CD) JP16.1 R25.2
SD_CLK: J4.5(CLK) JP19.2
SD_CMD: J4.3(CMD) JP18.2 R21.2
SD_DAT0: J4.7(DAT0) JP17.2 R22.2
SD_DAT1: J4.8(DAT1) R24.2
SD_DAT2: J4.1(DAT2) R23.2
SD_DAT3: J4.2(CD/DAT3) JP20.2 R20.2
SPI_CLK: JP19.1 ; port CLK
SPI_CS_SD: JP20.1 ; port CS
SPI_MISO: JP17.1 ; port MISO
SPI_MOSI: JP18.1 ; port MOSI

### Layout directives
net class SPI: SD_CLK, SD_CMD, SD_DAT0, SD_DAT3

### Notes on the sheet
- Decoupling SD
- Configuración mínima
- Pinout micro SD
- Nota de diseño:
  El solder jumper es también un placeholder para una resistencia que limite la corriente de inrush (generalmente un par de decenas de Ohms de ser necesario). Esta corriente aparece al conectar la SD en caliente (hot plug) o al encender el dispositivo.
- Nota de diseño:
  Las resistencias de pull up, aunque sea SPI, son necesarias para cumplir con el estándar SD. Los pines flotantes con estado indefinido generan mayor consumo. Además. algunas SD necesitan una pull up en MISO para inicializarse.
- Tarjeta Micro SD
- Nota de diseño:
  Si la SD no esta insertada, el pin card detect esta conectado a GND por medio de un switch. Al insertarla. el switch se abre.
  La pull up se usa para garantizar siempre un estado conocido, y el capacitor provee debouncing por hardware.
- Nota de diseño:
  El solder jumper de la linea CLK actua tambien como placeholder para colocar una resistencia que prevenga problemas de integridad de señal. como el ringing, en caso de necesitarlo. El valor puede ser de un par de decenas de Ohms (22 Ohms generalmente).
- Nota de diseño:
  Se omite la protección ESD por simplicidad, valiendose de la protección ESD que tiene el microcontrolador para el prototipo. En producto final recordar colocar la protección.

### Library data of the parts
C17 = Generic C: as C1 on sheet Power_Management; Case Code (Imperial): 0805; Capacitance: 10uF; Mount: Surface Mount; Depth: 1.25mm; Length: 2mm; Lead Free: Lead Free; Packaging: Tape and Reel; Width: 0.049inch; Package Quantity: 1; Height: 1.25mm; Case/Package: 0805; Voltage Rating: 10V; Thickness: 0.053inch; Max Operating Temperature: 85°C; Case Code (Metric): 2012; Contact Plating: Tin; Min Operating Temperature: -55°C; Radiation Hardening: No; Voltage Rating (DC): 10V
C18 = Generic C: as C5 on sheet MCU_Core; Case Code (Imperial): 0805; Mount: Surface Mount; Depth: 1.25mm; Length: 2mm; Lead Free: Lead Free; Packaging: Tape and Reel; Width: 0.049inch; Package Quantity: 1; Height: 1.25mm; Case/Package: 0805; Voltage Rating: 10V; Thickness: 0.053inch; Max Operating Temperature: 85°C; Case Code (Metric): 2012; Contact Plating: Tin; Min Operating Temperature: -55°C; Radiation Hardening: No; Voltage Rating (DC): 10V
J4 = MEM2061-01-188-00-A_revA: Micro SD Memory Card Connector, 1.88mm Profile SMT,Push Push, with normally closed switch
JP15-JP20 = Generic JP: Simbolo de jumper genérico
R20-R25 = Generic R: RES  47k 1% 0603
TP33 TP34 = Testpoint_SMD: Testpoint SMD de 1mm de diametro.

## Sheet Flex_Sensor.SchDoc
size A4; SheetNumber: 9; SheetTotal: 11
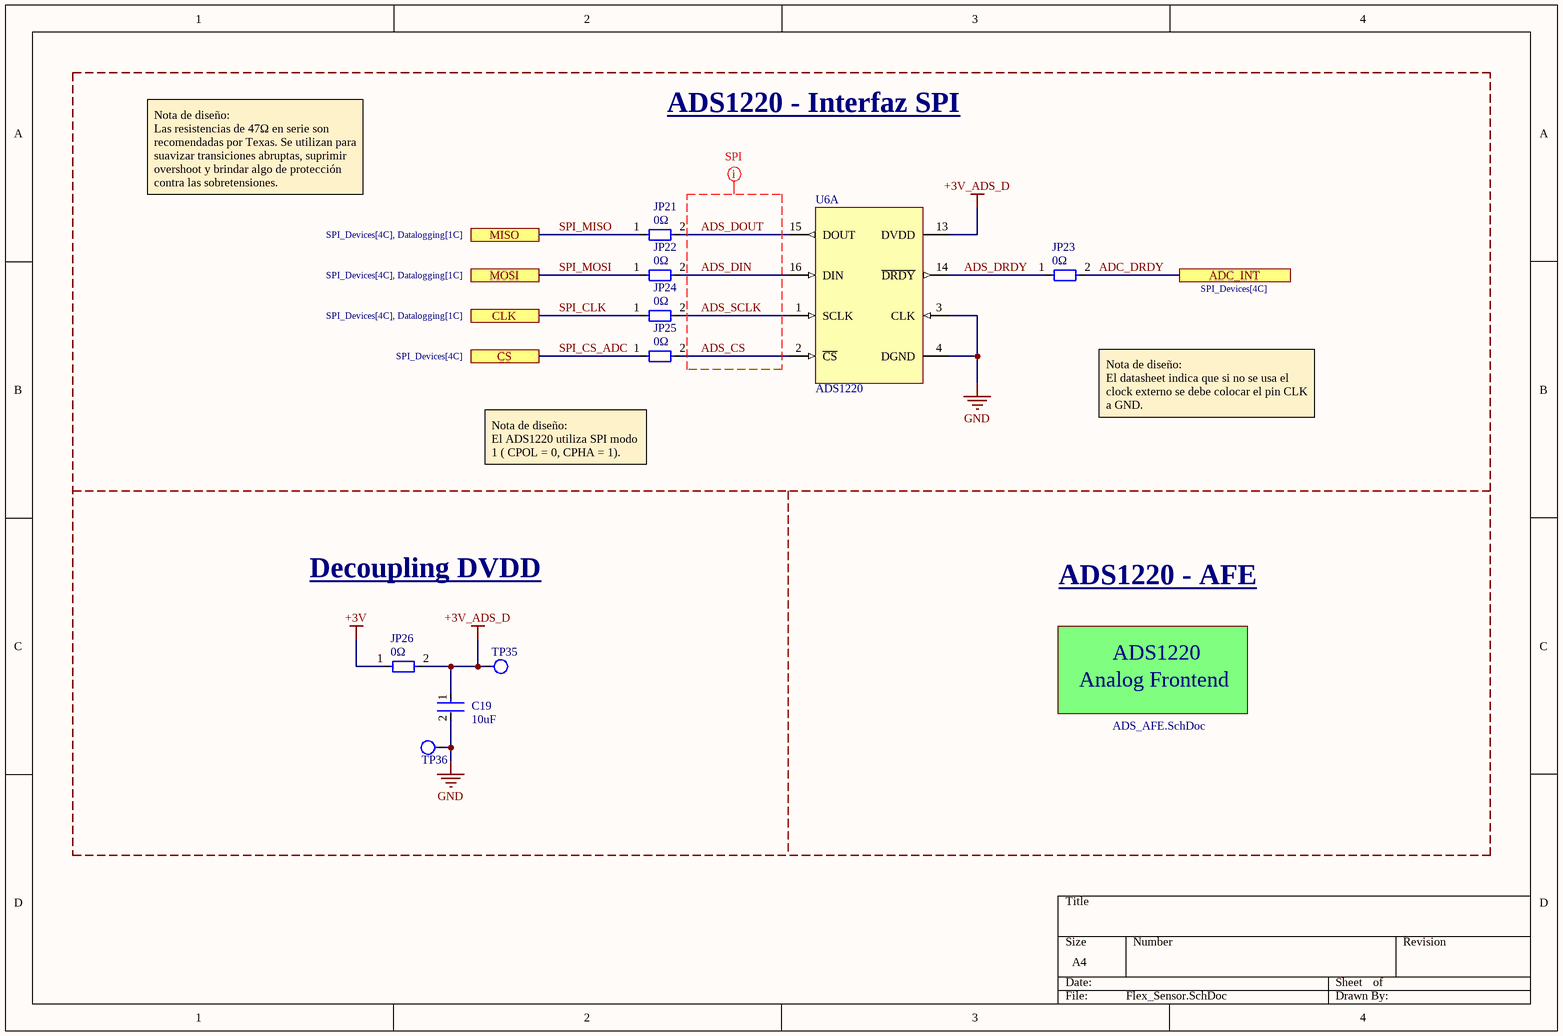
[diagram p8: Flex_Sensor.SchDoc]

### Parts
C19  10uF  [CAP_0603]
JP21  value 0Ω  [RES_0R_0603]  (hidden comment: Generic JP)  (no BOM)
JP22  value 0Ω  [RES_0R_0603]  (hidden comment: Generic JP)  (no BOM)
JP23  value 0Ω  [RES_0R_0603]  (hidden comment: Generic JP)  (no BOM)
JP24  value 0Ω  [RES_0R_0603]  (hidden comment: Generic JP)  (no BOM)
JP25  value 0Ω  [RES_0R_0603]  (hidden comment: Generic JP)  (no BOM)
JP26  value 0Ω  [RES_0R_0603]  (hidden comment: Generic JP)  (no BOM)
TP35  Testpoint SMD  [Testpoint_SMD]  (value not drawn)  (no BOM)
TP36  Testpoint SMD  [Testpoint_SMD]  (value not drawn)  (no BOM)
U6  ADS1220  [TSSOP-16]  (part A of 2)

### Sub-sheets
ADS_AFE = ADS_AFE.SchDoc: no entries  | Titulo: ADS1220; Titulo 2: Analog Frontend

### Ports
ADC_INT (see SPI_Devices[4C]), CLK (see SPI_Devices[4C], Datalogging[1C]), CS (see SPI_Devices[4C]), MISO (see SPI_Devices[4C], Datalogging[1C]), MOSI (see SPI_Devices[4C], Datalogging[1C])

### Nets
+3V: JP26.1
+3V_ADS_D: C19.1 JP26.2 TP35.1 U6.13(DVDD)
GND: C19.2 TP36.1 U6.3(CLK) U6.4(DGND)
ADC_DRDY: JP23.2 ; port ADC_INT
ADS_CS: JP25.2 U6.2(~{CS})
ADS_DIN: JP22.2 U6.16(DIN)
ADS_DOUT: JP21.2 U6.15(DOUT)
ADS_DRDY: JP23.1 U6.14(~{DRDY})
ADS_SCLK: JP24.2 U6.1(SCLK)
SPI_CLK: JP24.1 ; port CLK
SPI_CS_ADC: JP25.1 ; port CS
SPI_MISO: JP21.1 ; port MISO
SPI_MOSI: JP22.1 ; port MOSI

### Layout directives
net class SPI: ADS_CS, ADS_DIN, ADS_DOUT, ADS_SCLK

### Notes on the sheet
- ADS1220 - Interfaz SPI
- Nota de diseño:
  Las resistencias de 47Ω en serie son recomendadas por Texas. Se utilizan para suavizar transiciones abruptas, suprimir overshoot y brindar algo de protección contra las sobretensiones.
- Nota de diseño:
  El datasheet indica que si no se usa el clock externo se debe colocar el pin CLK a GND.
- Nota de diseño:
  El ADS1220 utiliza SPI modo 1 ( CPOL = 0, CPHA = 1).
- Decoupling DVDD
- ADS1220 - AFE

### Library data of the parts
C19 = Generic C: as C1 on sheet Power_Management; Case Code (Imperial): 0805; Capacitance: 10uF; Mount: Surface Mount; Depth: 1.25mm; Length: 2mm; Lead Free: Lead Free; Packaging: Tape and Reel; Width: 0.049inch; Package Quantity: 1; Height: 1.25mm; Case/Package: 0805; Voltage Rating: 10V; Thickness: 0.053inch; Max Operating Temperature: 85°C; Case Code (Metric): 2012; Contact Plating: Tin; Min Operating Temperature: -55°C; Radiation Hardening: No; Voltage Rating (DC): 10V
JP21-JP26 = Generic JP: Simbolo de jumper genérico
TP35 TP36 = Testpoint_SMD: Testpoint SMD de 1mm de diametro.
U6 = ADS1220: ADS1220 4-Channel, 2-kSPS, Low-Power, 24-Bit ADC with Integrated PGA and Reference

## Sheet ADS_AFE.SchDoc
size A4; SheetNumber: 10; SheetTotal: 11
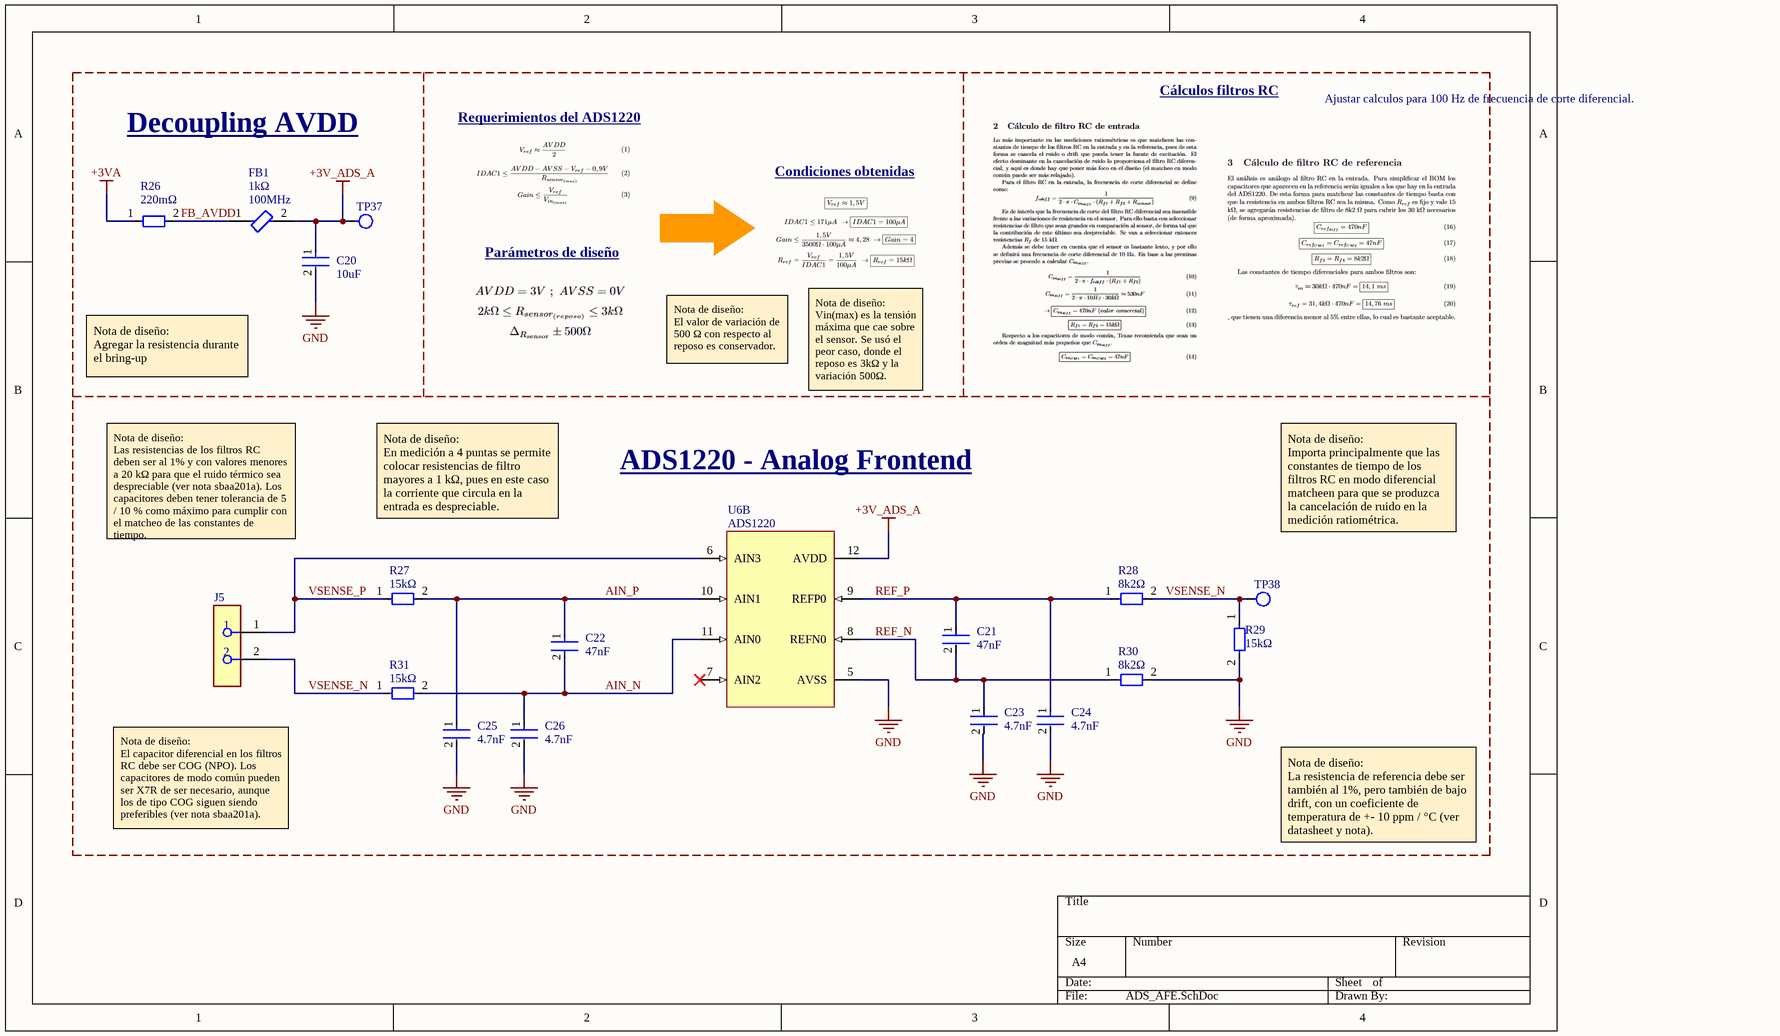
[diagram p9: ADS_AFE.SchDoc]

### Parts
C20  10uF  [CAP_0603]
C21  Capacitance: 47nF  [CAP_0603]  (hidden comment: 470nF)
C22  Capacitance: 47nF  [CAP_0603]  (hidden comment: 470nF)
C23  Capacitance: 4.7nF  [CAP_0603]  (hidden comment: 47nF)
C24  Capacitance: 4.7nF  [CAP_0603]  (hidden comment: 47nF)
C25  Capacitance: 4.7nF  [CAP_0603]  (hidden comment: 47nF)
C26  Capacitance: 4.7nF  [CAP_0603]  (hidden comment: 47nF)
FB1  Impedance: 1kΩ  Test Frequency: 100MHz  [FP-MPZ2012-IPC_B]  (hidden comment: MPZ2012S102AT000)
J5  PPTC021LGBN-RC  [FP-PPTC021LGBN-RC-MFG]  (value not drawn)
R26  value 220mΩ  [RES_0603]  (hidden comment: 220mOhm)
R27  value 15kΩ  [RES_0603]  (hidden comment: 15k)
R28  value 8k2Ω  [RES_0603]  (hidden comment: 8k2)
R29  value 15kΩ  [RES_0603]  (hidden comment: 15k REF)
R30  value 8k2Ω  [RES_0603]  (hidden comment: 8k2)
R31  value 15kΩ  [RES_0603]  (hidden comment: 15k)
TP37  Testpoint SMD  [Testpoint_SMD]  (value not drawn)  (no BOM)
TP38  Testpoint SMD  [Testpoint_SMD]  (value not drawn)  (no BOM)
U6  ADS1220  [TSSOP-16]  (part B of 2)

### Nets
+3V_ADS_A: C20.1 FB1.2 TP37.1 U6.12(AVDD)
+3VA: R26.1
GND: C20.2 C23.2 C24.2 C25.2 C26.2 R29.2 R30.2 U6.5(AVSS)
AIN_N: C22.2 C26.1 R31.2 U6.11(AIN0)
AIN_P: C22.1 C25.1 R27.2 U6.10(AIN1)
FB_AVDD: FB1.1 R26.2
REF_N: C21.2 C23.1 R30.1 U6.8(REFN0)
REF_P: C21.1 C24.1 R28.1 U6.9(REFP0)
VSENSE_N: J5.2 R28.2 R29.1 R31.1 TP38.1
VSENSE_P: J5.1 R27.1 U6.6(AIN3)

Not connected (* = marked no-connect by the designer): U6 7(AIN2)*

### Notes on the sheet
- Cálculos filtros RC
- Ajustar calculos para 100 Hz de frecuencia de corte diferencial.
- Decoupling AVDD
- Requerimientos del ADS1220
- Condiciones obtenidas
- Parámetros de diseño
- Nota de diseño:
  Agregar la resistencia durante el bring-up
- Nota de diseño:
  El valor de variación de 500 Ω con respecto al reposo es conservador.
- Nota de diseño:
  Vin(max) es la tensión máxima que cae sobre el sensor. Se usó el peor caso, donde el reposo es 3kΩ y la variación 500Ω.
- Nota de diseño:
  En medición a 4 puntas se permite colocar resistencias de filtro mayores a 1 kΩ, pues en este caso la corriente que circula en la entrada es despreciable.
- ADS1220 - Analog Frontend
- Nota de diseño:
  Las resistencias de los filtros RC deben ser al 1% y con valores menores a 20 kΩ para que el ruido térmico sea despreciable (ver nota sbaa201a). Los capacitores deben tener tolerancia de 5 / 10 % como máximo para cumplir con el matcheo de las constantes de tiempo.
- Nota de diseño:
  Importa principalmente que las constantes de tiempo de los filtros RC en modo diferencial matcheen para que se produzca la cancelación de ruido en la medición ratiométrica.
- Nota de diseño:
  El capacitor diferencial en los filtros RC debe ser COG (NPO). Los capacitores de modo común pueden ser X7R de ser necesario, aunque los de tipo COG siguen siendo preferibles (ver nota sbaa201a).
- Nota de diseño:
  La resistencia de referencia debe ser también al 1%, pero también de bajo drift, con un coeficiente de temperatura de +- 10 ppm / °C (ver datasheet y nota).

### Library data of the parts
C20 = Generic C: as C1 on sheet Power_Management; Case Code (Imperial): 0805; Capacitance: 10uF; Mount: Surface Mount; Depth: 1.25mm; Length: 2mm; Lead Free: Lead Free; Packaging: Tape and Reel; Width: 0.049inch; Package Quantity: 1; Height: 1.25mm; Case/Package: 0805; Voltage Rating: 10V; Thickness: 0.053inch; Max Operating Temperature: 85°C; Case Code (Metric): 2012; Contact Plating: Tin; Min Operating Temperature: -55°C; Radiation Hardening: No; Voltage Rating (DC): 10V
C21 C22 = Generic C: Cap 470 nF 10V C0G 0603; Dielectric: X5R; Tolerance: 10%; Case Code (Imperial): 0805; Mount: Surface Mount; Depth: 1.25mm; Length: 2mm; Lead Free: Lead Free; Packaging: Tape and Reel; Width: 0.049inch; Package Quantity: 1; Height: 1.25mm; Case/Package: 0805; Voltage Rating: 10V; Thickness: 0.053inch; Max Operating Temperature: 85°C; Case Code (Metric): 2012; Contact Plating: Tin; Min Operating Temperature: -55°C; Radiation Hardening: No; Voltage Rating (DC): 10V
C23-C26 = Generic C: Cap 47 nF 10V X7R 0603; Dielectric: X5R; Tolerance: 10%; Case Code (Imperial): 0805; Mount: Surface Mount; Depth: 1.25mm; Length: 2mm; Lead Free: Lead Free; Packaging: Tape and Reel; Width: 0.049inch; Package Quantity: 1; Height: 1.25mm; Case/Package: 0805; Voltage Rating: 10V; Thickness: 0.053inch; Max Operating Temperature: 85°C; Case Code (Metric): 2012; Contact Plating: Tin; Min Operating Temperature: -55°C; Radiation Hardening: No; Voltage Rating (DC): 10V
FB1 = CMP-08257-000042-1: FERRITE BEAD 1 KOHM 0805 1LN; Max DC Current: 1.5A; Tolerance: 25%; DC Resistance (DCR): 150mR; Depth: 1.25mm; REACH SVHC: No SVHC; Case Code (Imperial): 0805; Length: 0.079inch; Core Material: Ferrite; Mount: Surface Mount; Packaging: Tape and Reel; Case/Package: 0805; Weight: 0.000194oz; Width: 1.25mm; Height: 0.85mm; Case Code (Metric): 2012; Max Operating Temperature: 125°C; Termination: SMD/SMT; Current Rating: 1.5A; Min Operating Temperature: -55°C; RoHS Compliant: Yes; Package Quantity: 4000
J5 = CMP-00595-00270342-1: PPTC021LGBN-RC 2 Position Total Single Row 2.54 mm Pitch Right Angle Female Header; NexarPartId: 270342; Pitch: 2.54mm; Current Rating: 3A; Number of Positions: 2; Voltage Rating: 250V; Connector Type: Header, Socket; Lead Free: Lead Free; Height: 2.4mm; Contact Material: Bronze, Nickel, Tin; Color: Black; RoHS: Compliant; Width: 8.5mm; Min Operating Temperature: -40°C; Housing Color: Black; Max Operating Temperature: 105°C; Termination: Solder; Mount: Through Hole; Packaging: Bulk; Contact Plating: Tin; Number of Rows: 1; Housing Material: Plastic; Length: 5.58mm; Number of Contacts: 2
R26 = Generic R: RES  220mOhm 1% 0603
R27 R31 = Generic R: RES  15k 1% 0603
R28 R30 = Generic R: RES  8k2 1% 0603
R29 = Generic R: RES  8k2 1% 0603, low drift  +- 10 ppm / °C.
TP37 TP38 = Testpoint_SMD: Testpoint SMD de 1mm de diametro.
U6 = ADS1220: as U6 on sheet Flex_Sensor

## Sheet Debugging_Leds.SchDoc
size A4; SheetNumber: 11; SheetTotal: 11
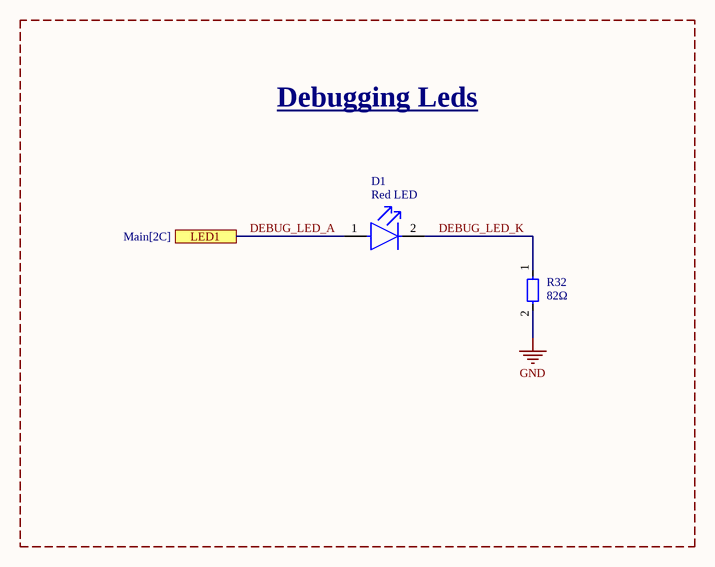
[diagram p10: Debugging_Leds.SchDoc]

### Parts
D1  Red LED  [FP-SML-LX0805SRC-TR-MFG]
R32  value 82Ω  [RES_0603]  (hidden comment: 82R)

### Blocks framed on the sheet
Debugging Leds: D1 R32

### Ports
LED1 (see Main[2C])

### Nets
GND: R32.2
DEBUG_LED_A: D1.1(A) ; port LED1
DEBUG_LED_K: D1.2(C) R32.1

### Library data of the parts
D1 = CMP-57192-000013-1: LED RED CLEAR SMD SML-LX0805SRC-TR; Forward Current: 20mA; Wavelength: 660nm; Forward Voltage: 1.7V; Luminous Intensity: 25mcd; Number of LEDs: 1; Current Rating: 25mA; Lens Color: Colorless; Power Rating: 100mW; Viewing Angle: 140°; Approvals: UL; Lens Transparency: Clear; Series: -; Package Quantity: 3000; Mount: Surface Mount; Lead Free: Lead Free; Case/Package: 0805; Max Operating Temperature: 85°C; Illumination Color: Red; Packaging: Tape and Reel; Length: 2mm; Lens Style: Clear; Width: 1.25mm; RoHS Compliant: Yes; Color: Red; Case Code (Metric): 2012; Dominant Wavelength: 660nm; Number of Pins: 2; Min Operating Temperature: -40°C; Case Code (Imperial): 0805; Voltage Rating (DC): 1.7V; Voltage Rating: 1.7V; Height: 1.2mm; Test Current: 20mA
R32 = Generic R: RES  82R 1% 0603

## Nets that join several sheets
+3V: Power_Management (C2.1 TP2.1 U2.5), MCU_Core (JP1.1), I2C_Devices (JP2.1 JP7.1), BLE_Connectivity (JP10.1), Datalogging (JP15.1), Flex_Sensor (JP26.1)
+3V_MCU: MCU_Core (15 pins), I2C_Devices (R6.1 R7.1)
+3VA: Power_Management (C4.1 TP6.1 U3.5), ADS_AFE (R26.1)
GND: Power_Management (12 pins), MCU_Core (21 pins), I2C_Devices (15 pins), BLE_Connectivity (6 pins), Light_Monitoring (R12.2), SPI_Devices (TP32.1), Datalogging (6 pins), Flex_Sensor (C19.2 TP36.1 U6.3 U6.4), ADS_AFE (8 pins), Debugging_Leds (R32.2)
ADC_DRDY: SPI_Devices (R19.2 TP31.1), Flex_Sensor (JP23.2)
ADC_DRDY_MCU: Main (U1.30), SPI_Devices (R19.1)
BAT_SENSE: Main (U1.14), Power_Management (R1.2 R2.1 TP4.1)
BLE_EN: Main (U1.40), BLE_Connectivity (JP12.2 TP20.1)
BLE_STATE: Main (U1.39), BLE_Connectivity (JP14.2)
CARD_DET: SPI_Devices (R18.2 TP30.1), Datalogging (JP16.2)
CARD_DET_MCU: Main (U1.32), SPI_Devices (R18.1)
DEBUG_LED_A: Main (U1.25), Debugging_Leds (D1.1)
EN_3VA: Main (U1.13), Power_Management (TP7.1 U3.3)
EN_BSENSE: Main (U1.15), Power_Management (Q1.1 R3.1 TP5.1)
EN_LIGHT_MON: Main (U1.16), Light_Monitoring (R11.1 TP23.1)
I2C_SCL: Main (U1.21), I2C_Devices (JP3.1 JP5.1 R6.2 TP11.1)
I2C_SDA: Main (U1.22), I2C_Devices (JP4.1 JP8.1 R7.2 TP12.1)
LIGHT_MON: Main (U1.17), Light_Monitoring (R11.2 R12.1 TP24.1)
MCU_BOOT: Main (U1.44), MCU_Core (R5.1)
MCU_OSC_IN: Main (U1.5), MCU_Core (C13.1 Y1.1)
MCU_OSC_OUT: Main (U1.6), MCU_Core (R4.2)
MCU_RESET: Main (U1.7), MCU_Core (C5.1 S1.1 S1.2)
RTC_INT: Main (U1.10), I2C_Devices (JP6.2)
RTC_RST: Main (U1.12), I2C_Devices (JP9.2 TP16.1)
RX_MCU: Main (U1.43), BLE_Connectivity (JP11.1 TP19.1)
SPI_CLK: SPI_Devices (R15.2 TP27.1), Datalogging (JP19.1), Flex_Sensor (JP24.1)
SPI_CLK_MCU: Main (U1.26), SPI_Devices (R15.1)
SPI_CS_ADC: SPI_Devices (R17.2 TP29.1), Flex_Sensor (JP25.1)
SPI_CS_ADC_MCU: Main (U1.29), SPI_Devices (R17.1)
SPI_CS_SD: SPI_Devices (R16.2 TP28.1), Datalogging (JP20.1)
SPI_CS_SD_MCU: Main (U1.31), SPI_Devices (R16.1)
SPI_MISO: SPI_Devices (R13.2 TP25.1), Datalogging (JP17.1), Flex_Sensor (JP21.1)
SPI_MISO_MCU: Main (U1.27), SPI_Devices (R13.1)
SPI_MOSI: SPI_Devices (R14.2 TP26.1), Datalogging (JP18.1), Flex_Sensor (JP22.1)
SPI_MOSI_MCU: Main (U1.28), SPI_Devices (R14.1)
SWCLK: Main (U1.37), MCU_Core (J2.3)
SWDIO: Main (U1.34), MCU_Core (J2.2)
TX_MCU: Main (U1.42), BLE_Connectivity (JP13.1 TP21.1)